# EAGLE board motherboard_schematic_ver_1_0 (EAGLE 7.5.0), part 1 of 2
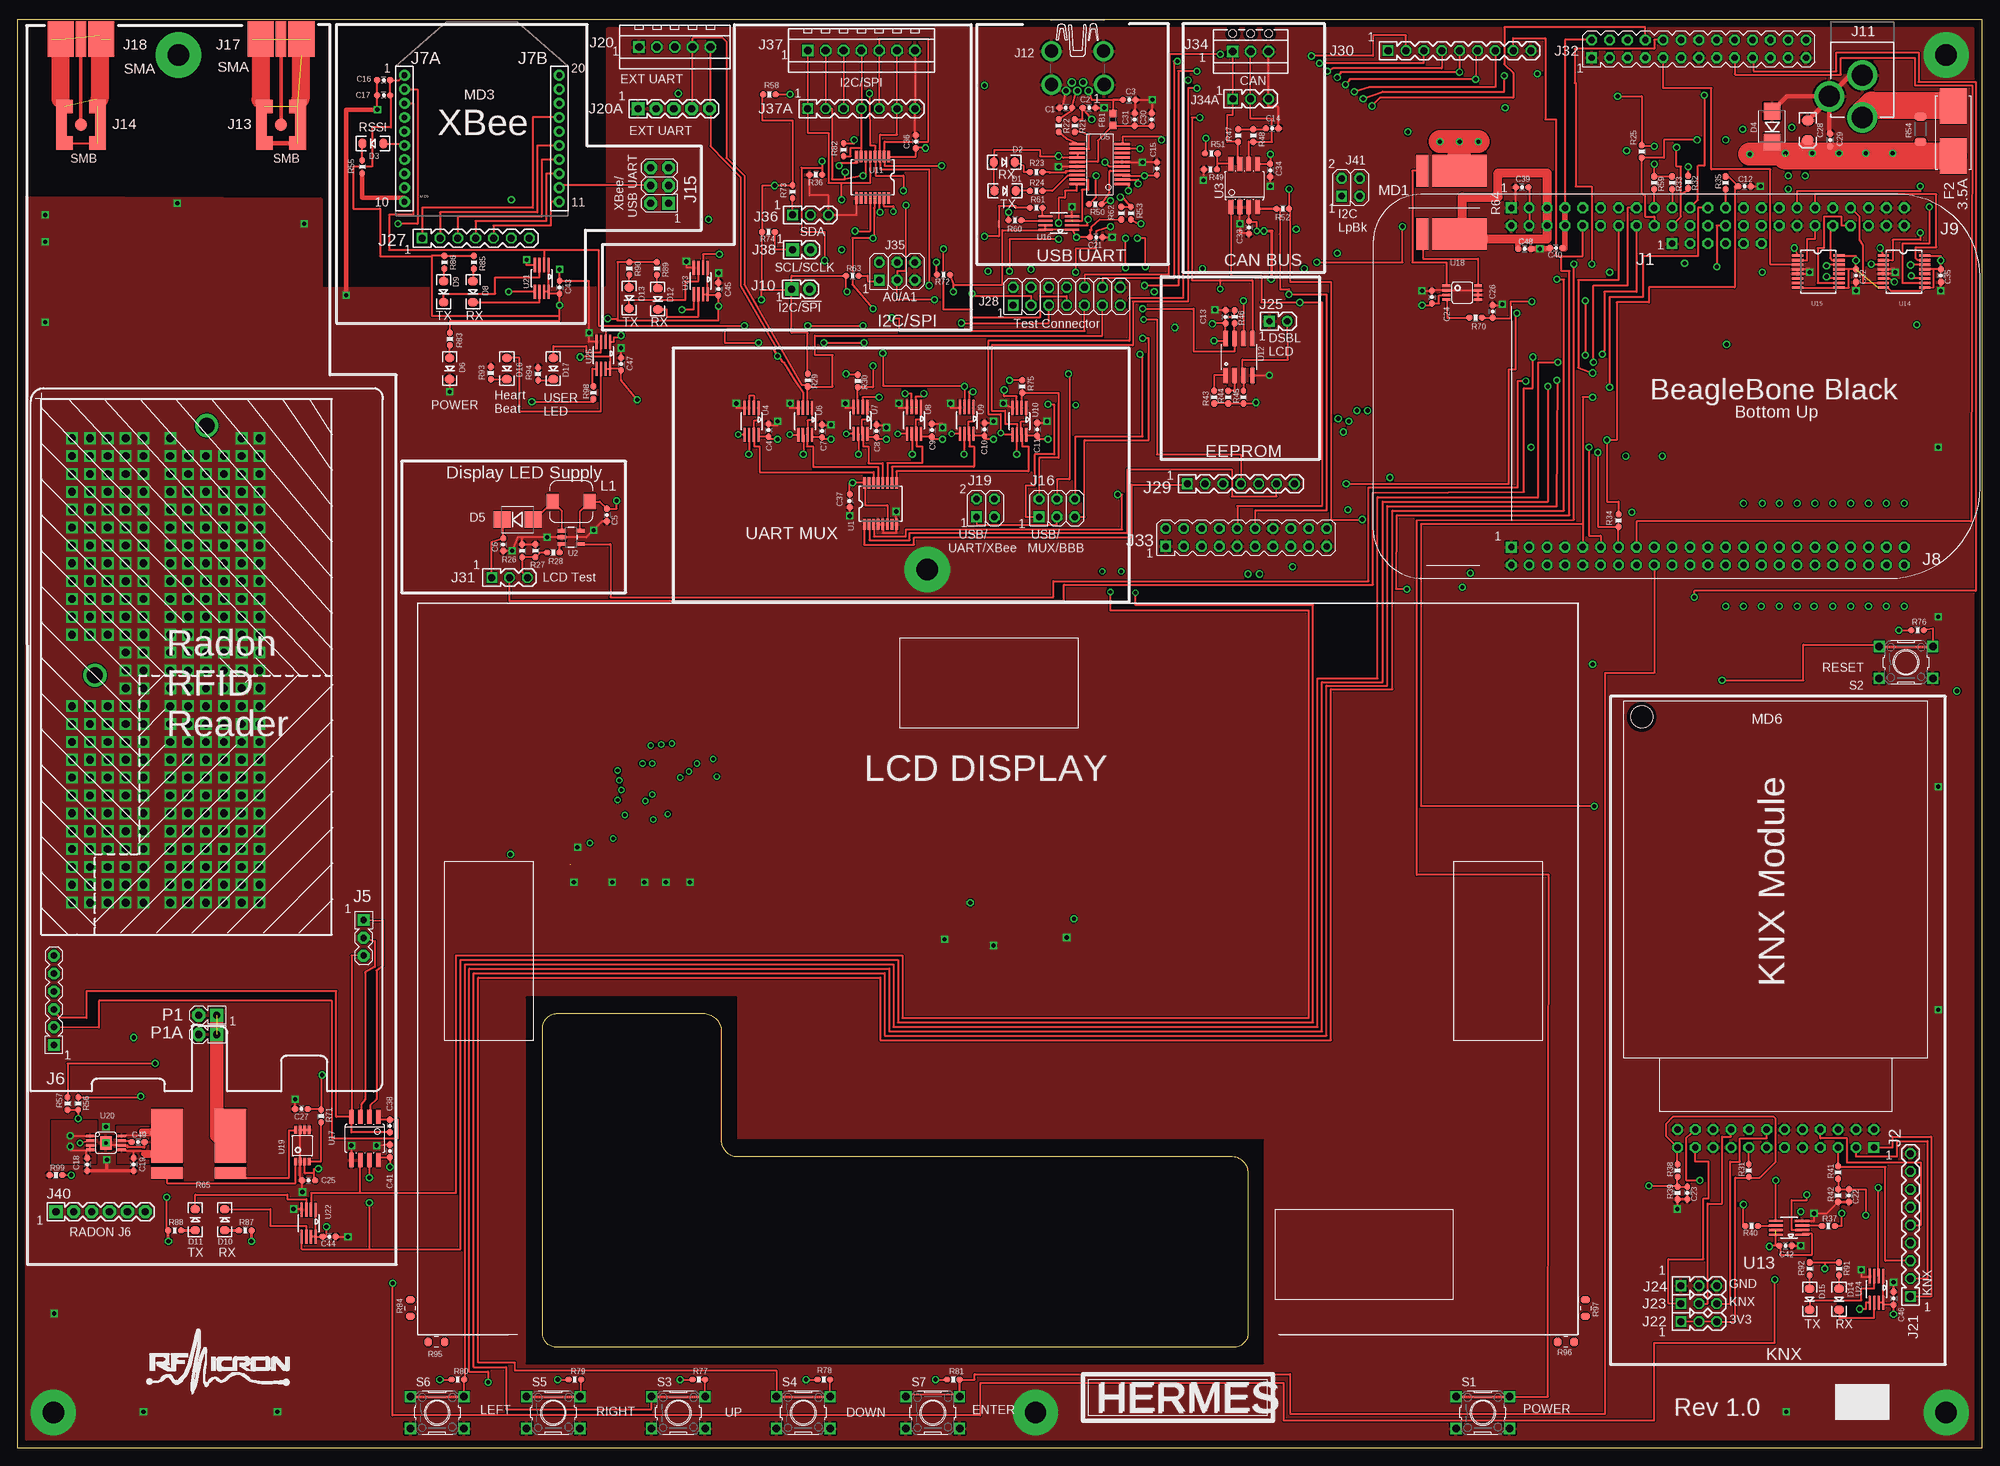
[diagram p9: board, top side]
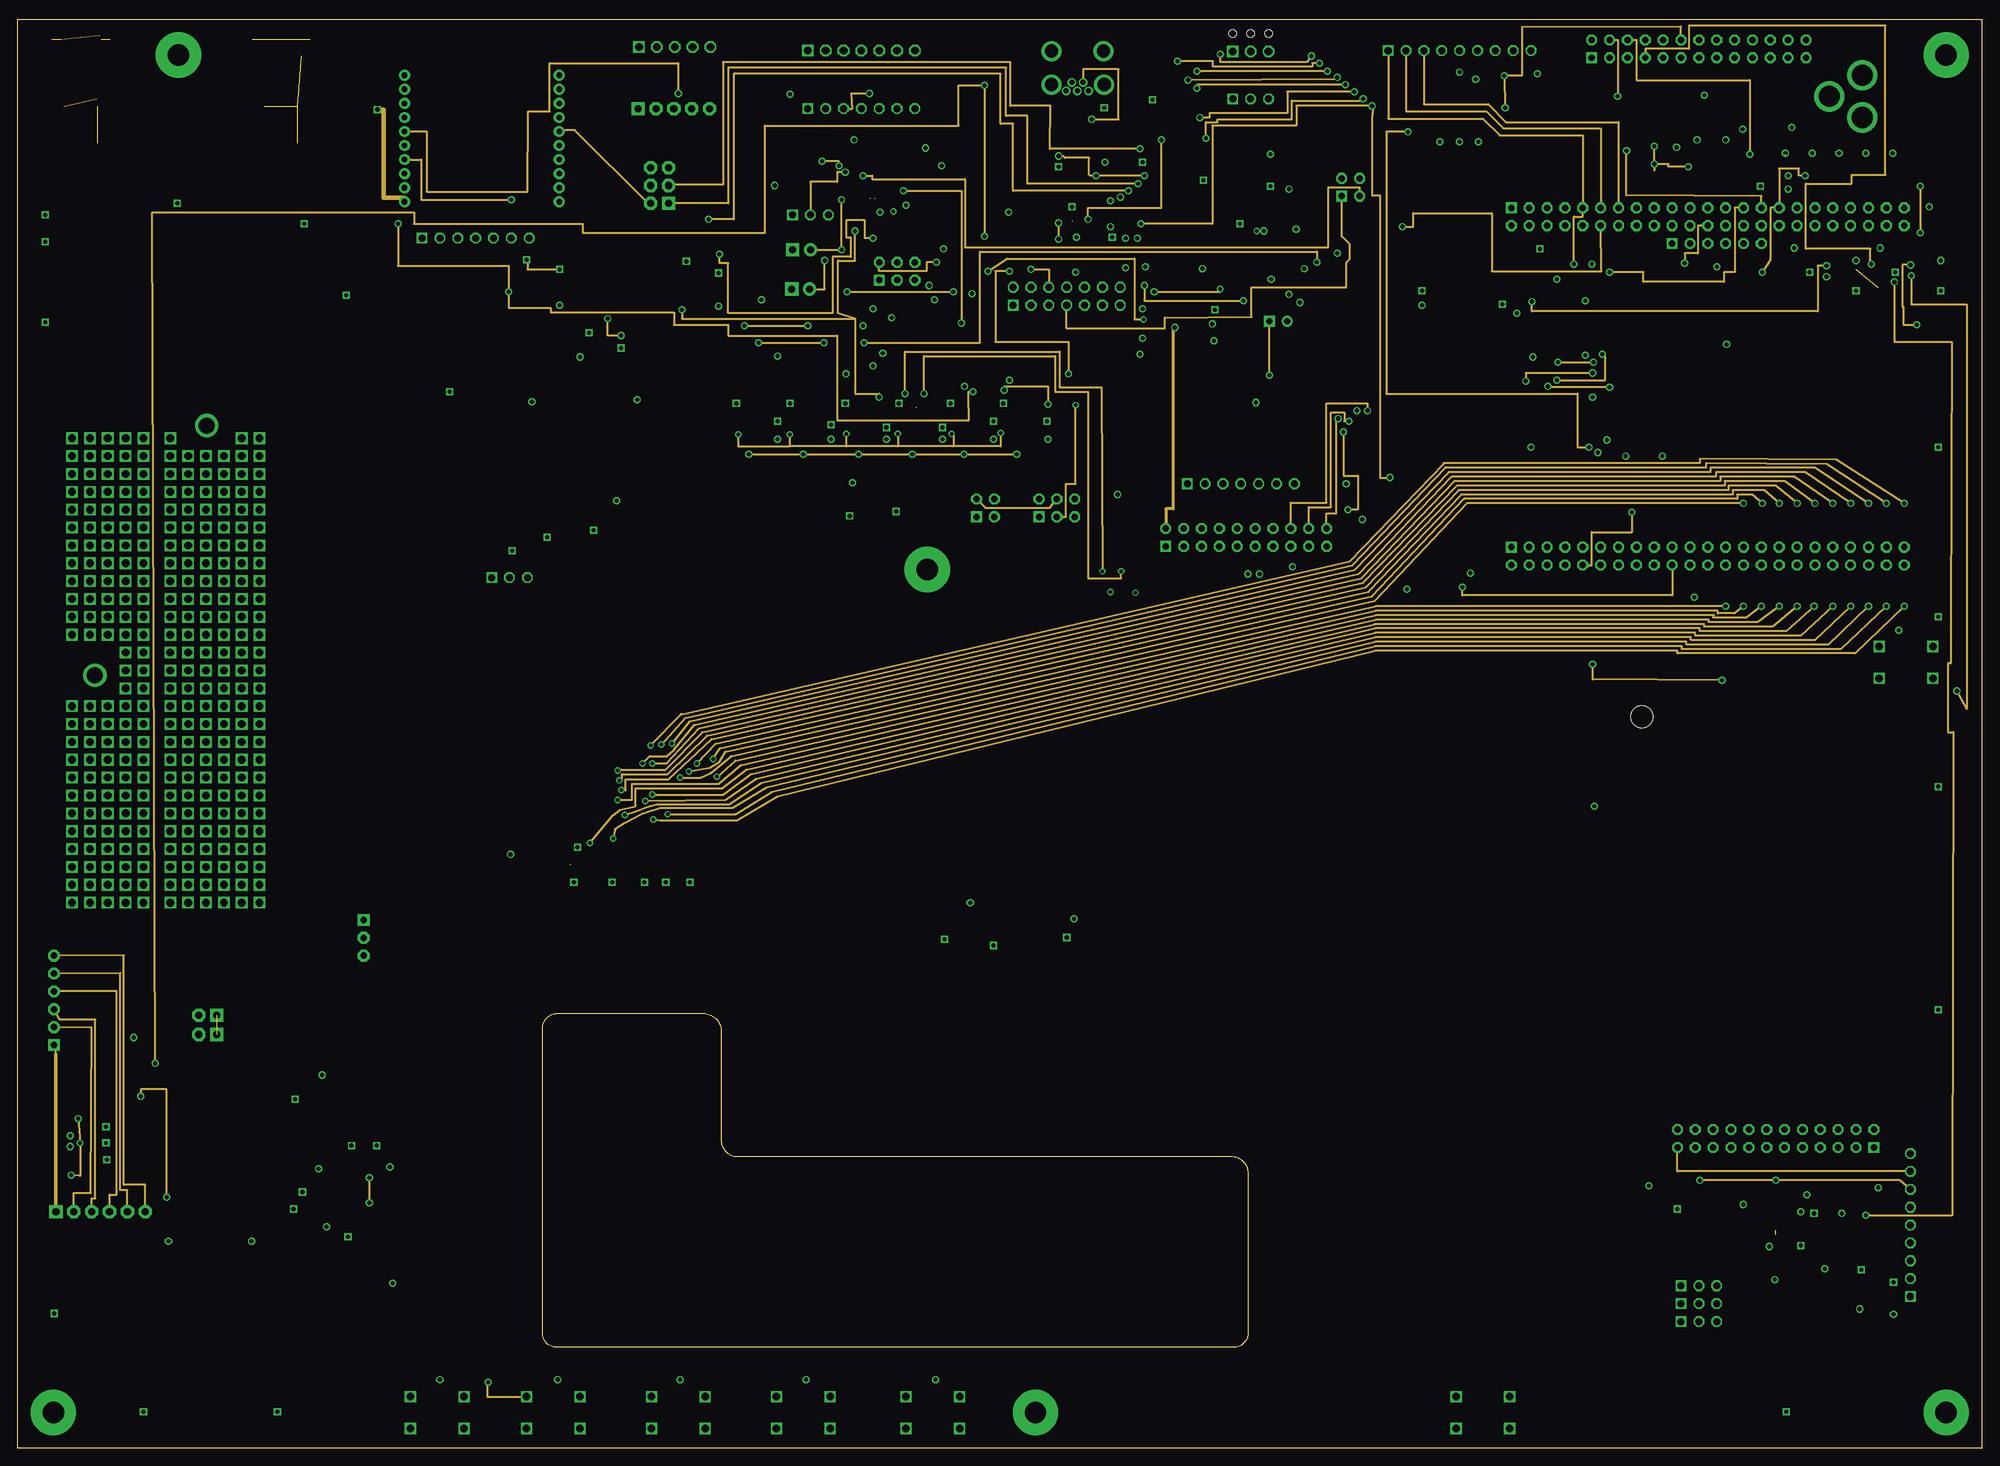
[diagram p10: board, inner layer SI1]
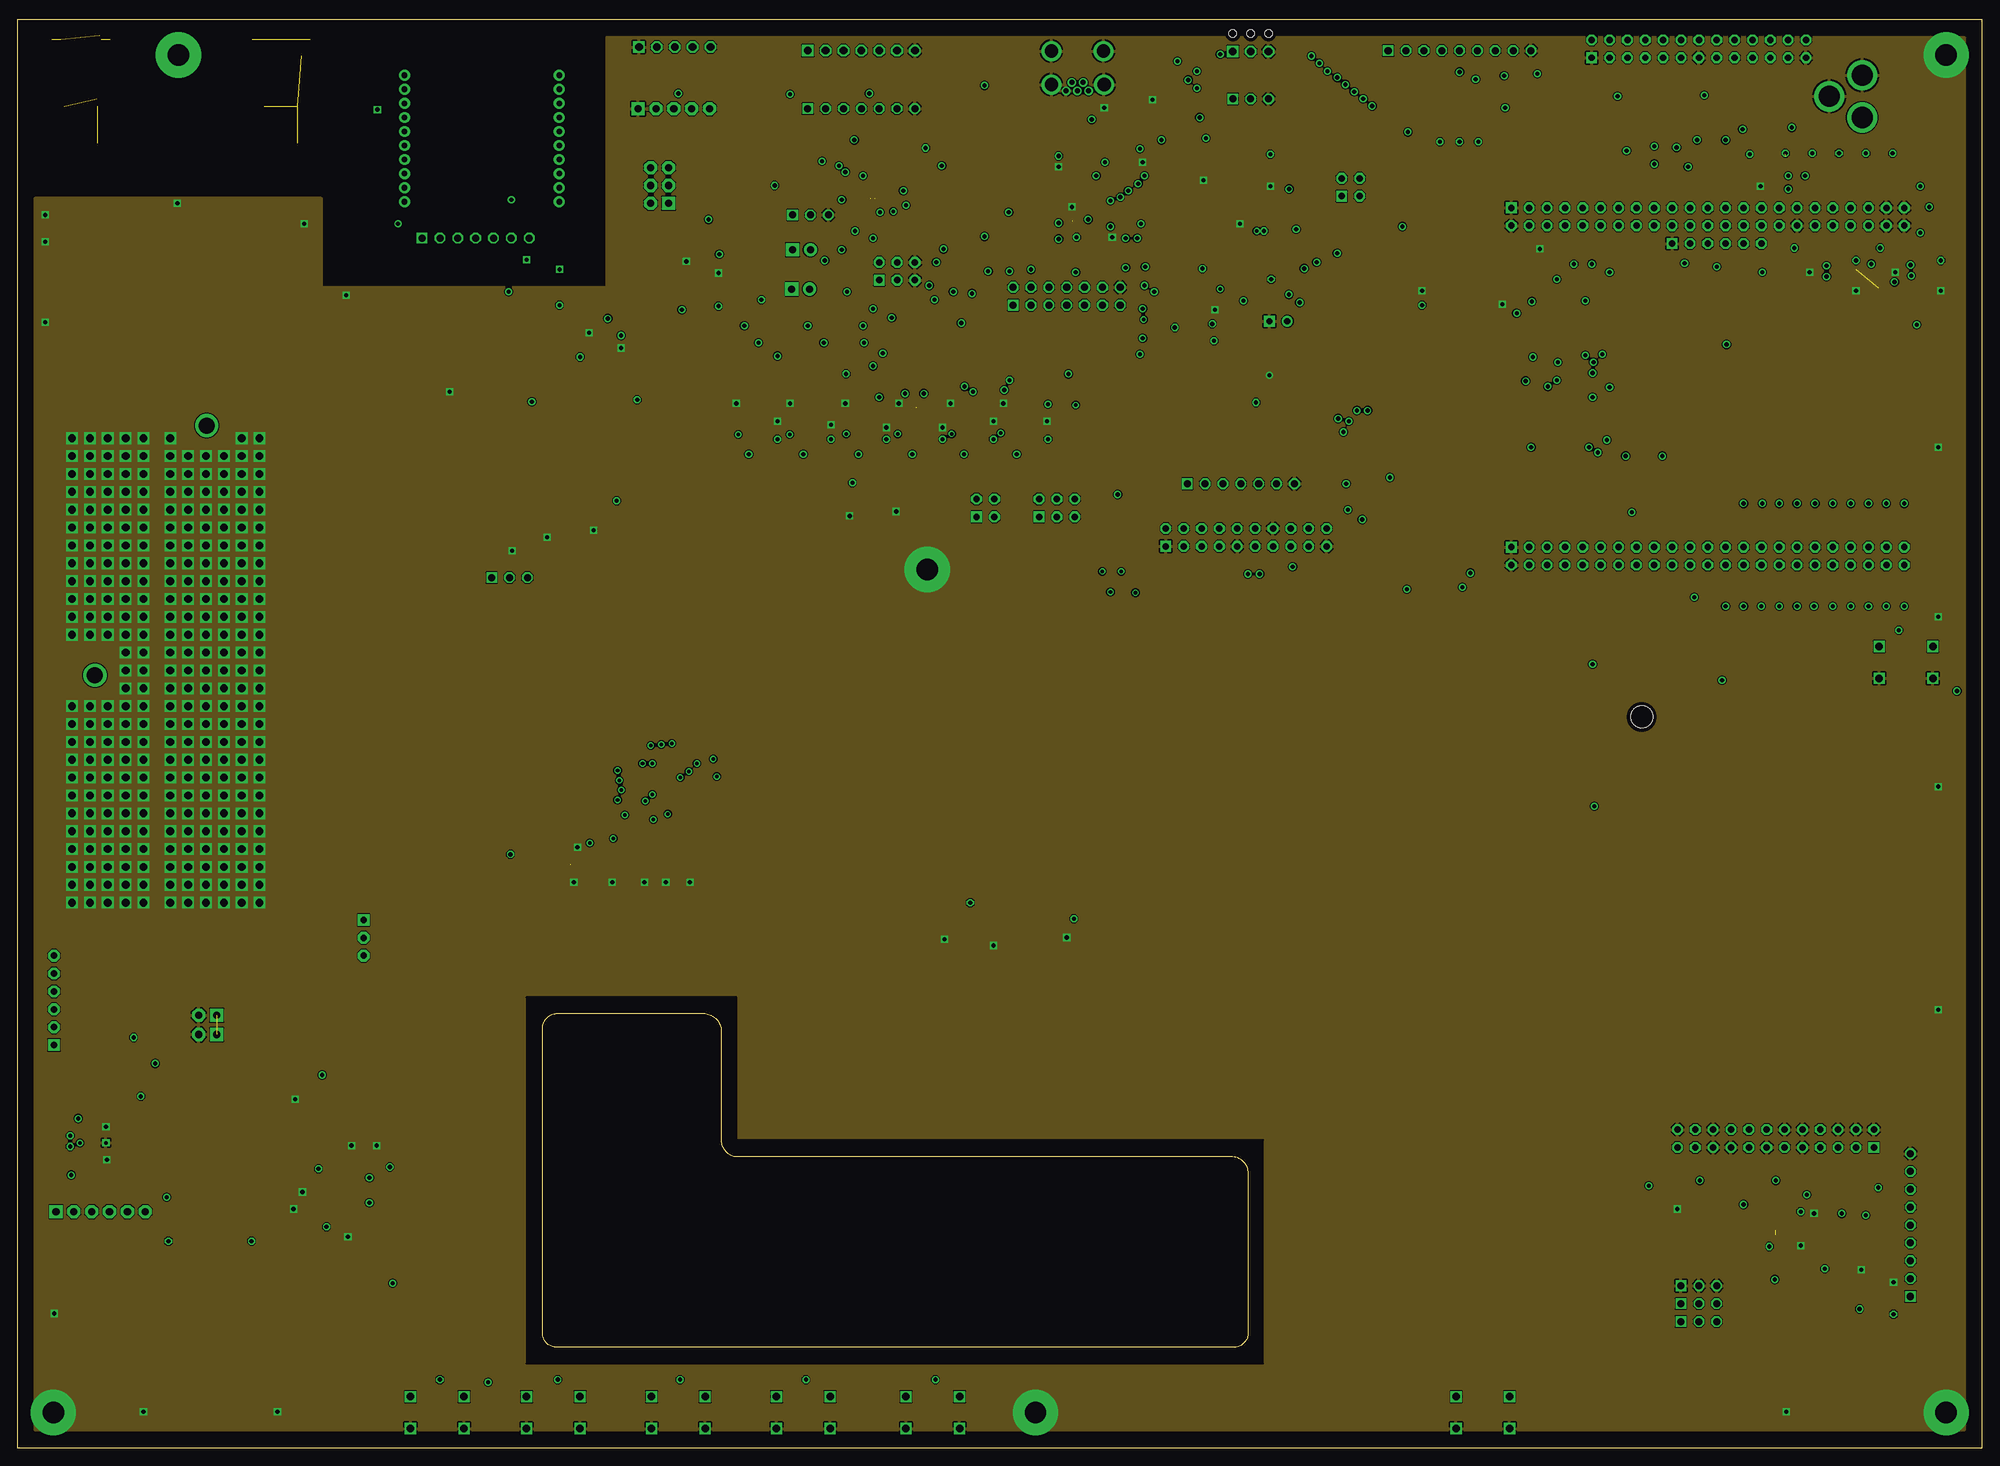
[diagram p11: board, inner layer GND]
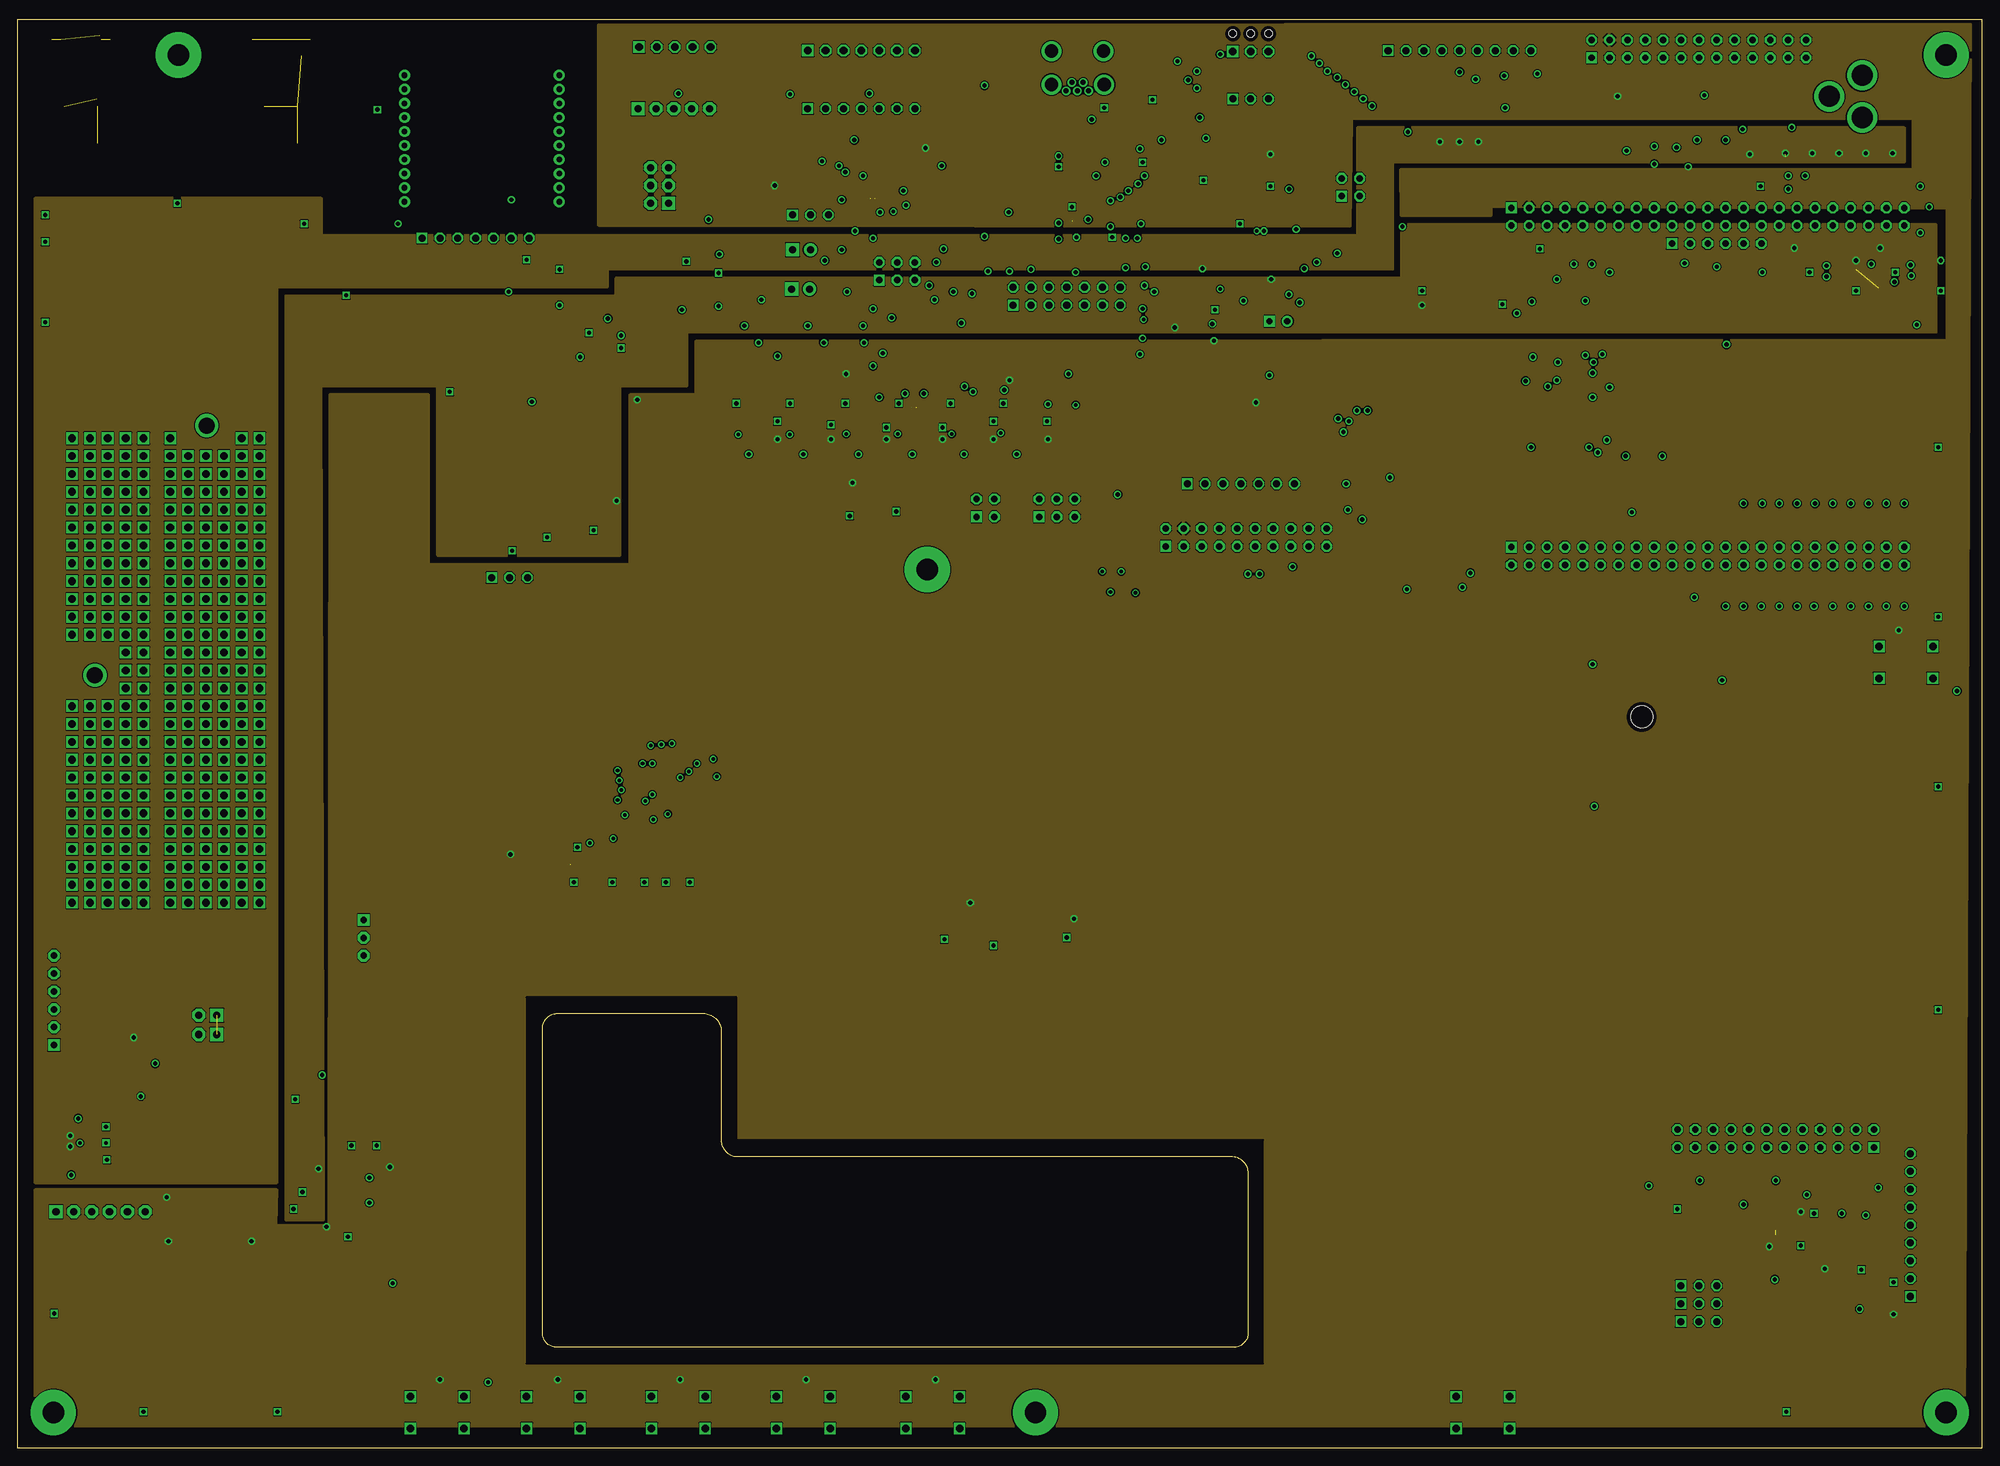
[diagram p12: board, inner layer PWR]
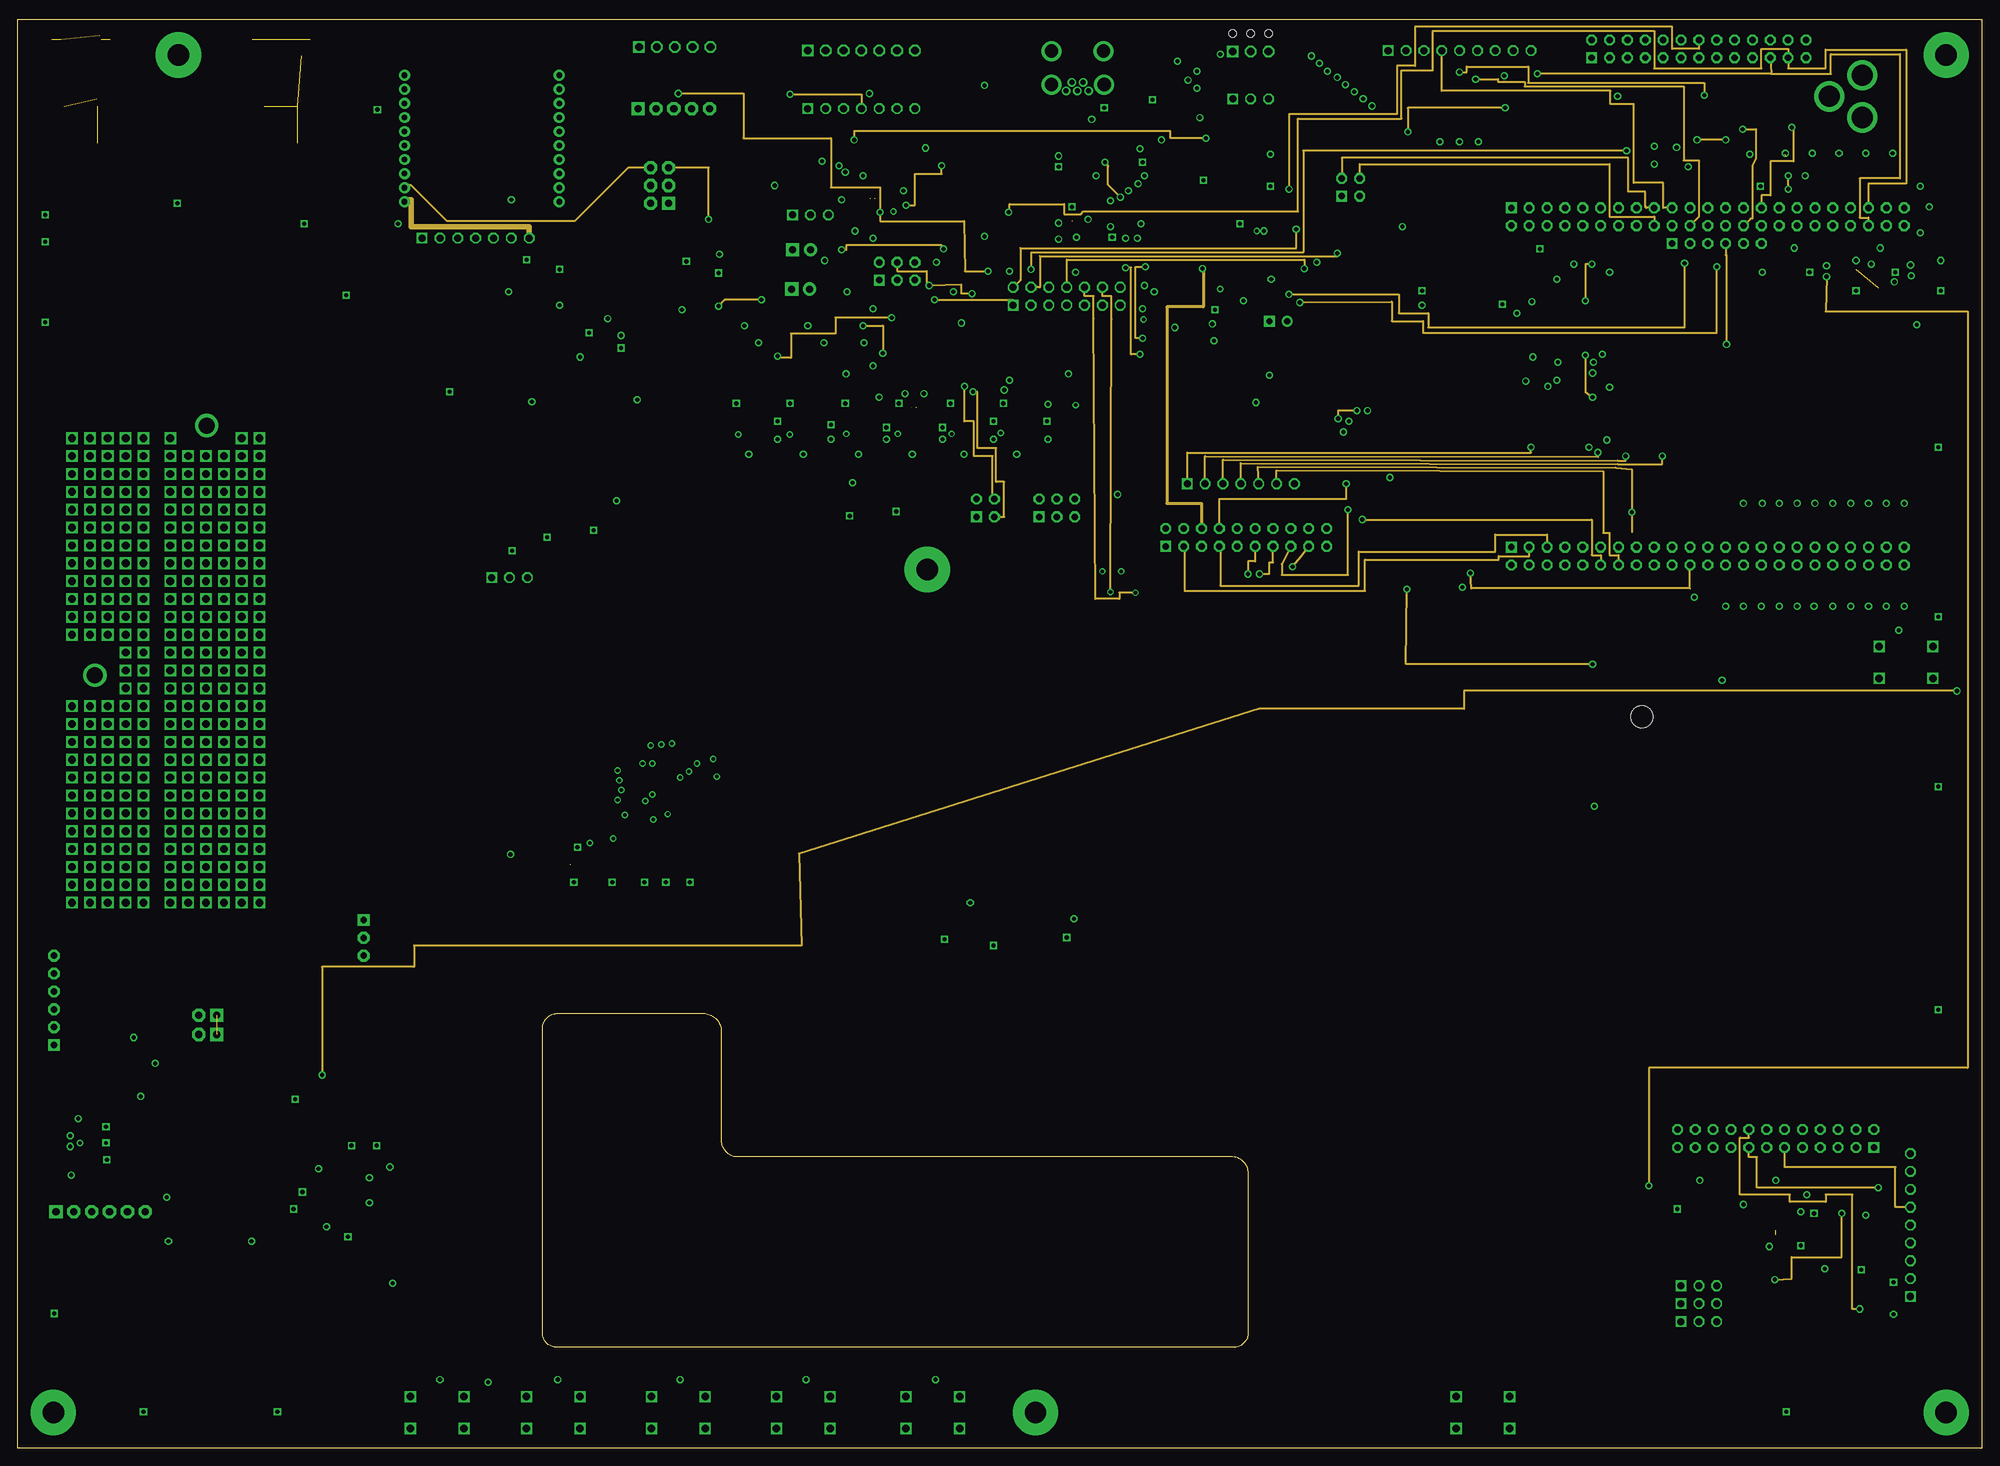
[diagram p13: board, inner layer SI2]
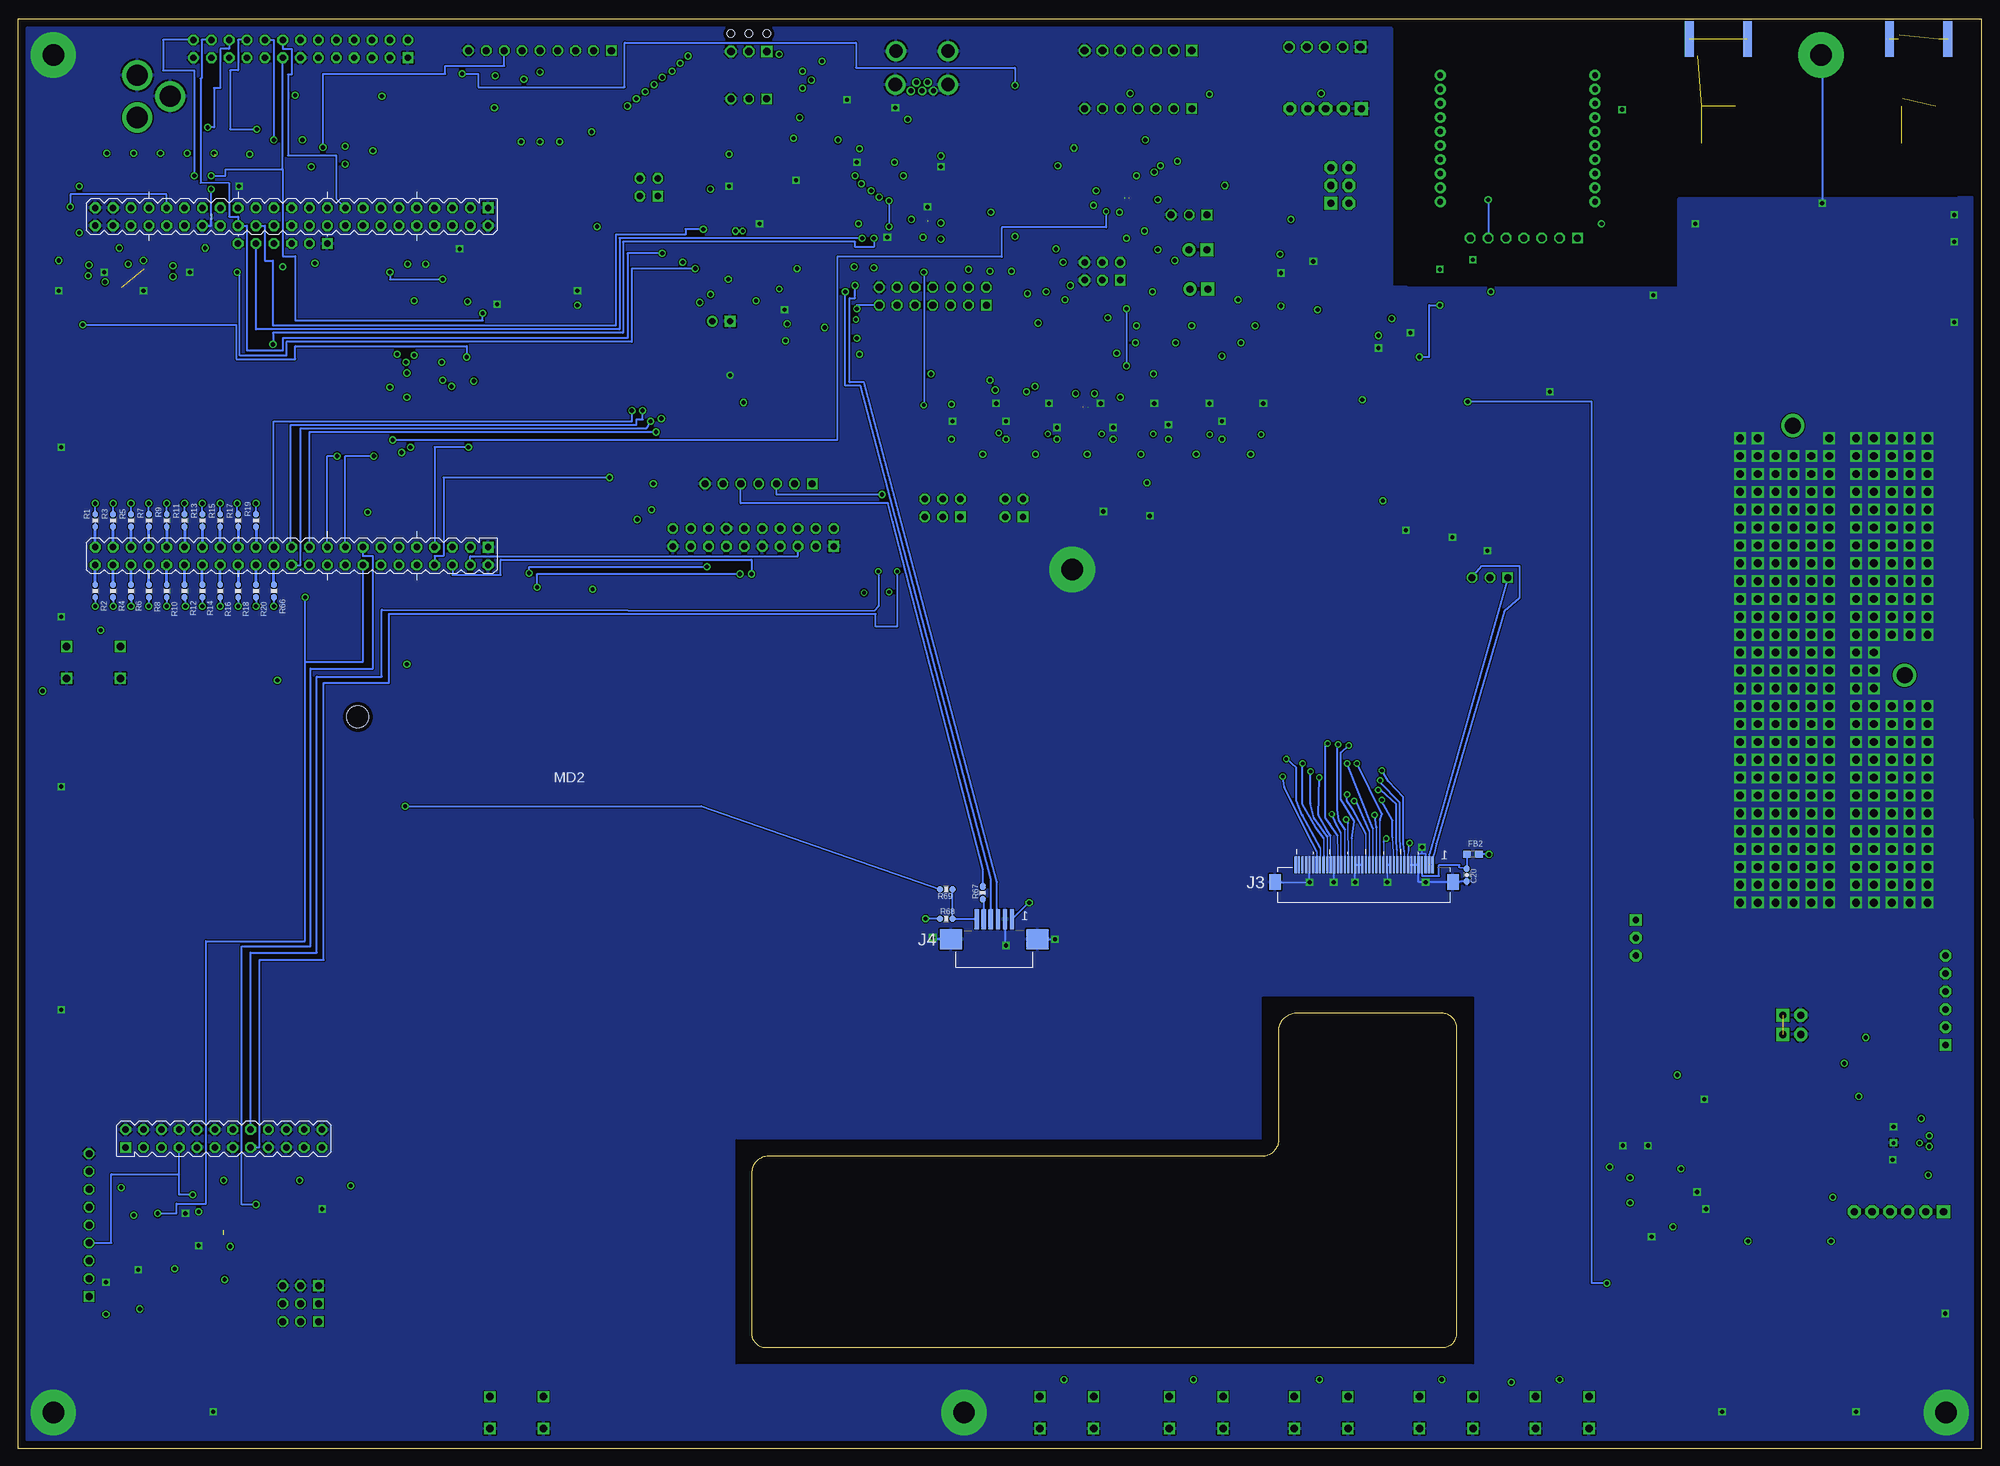
[diagram p14: board, bottom side, seen from below]

Size 279.4 x 203.2 mm. Coordinates in mm from the lower left corner, seen from the top.
Outline: 0,0 0,203.2 279.4,203.2 279.4,0 0,0
Copper layers (1*2+3*4+5*16): Top 0.035mm / dielectric 1.5mm / SI1 0.035mm / dielectric 0.15mm / GND 0.035mm / dielectric 0.2mm / PWR 0.035mm / dielectric 0.15mm / SI2 0.035mm / dielectric 0.2mm / Bottom 0.035mm
Design rules "default *": minimum track width 6mil, minimum drill 0.3mm, track to track 6mil, track to pad 6mil, pad to pad 6mil, via to via 8mil, smd to smd 6mil, copper to edge 20mil, drill to drill 8mil, minimum pad ring 10mil, minimum via ring 8mil, stop-mask expansion 6mil, vias tented up to drill 0mil, thermal gap 10mil

## Footprints (pad centres in the part's own frame; a part is rotated, then mirrored left to right if it is on the bottom)
0603-CAP = smd 0.9 x 0.8: 1 -0.9,0; 2 0.9,0
EIA3216 = smd 1.4 x 1.6: A 1.4,0; C -1.4,0
LED-1206 = smd 1.2 x 1.4: A -1.5,0; C 1.5,0
SC-110A-POWER_DIODE = smd 2.4 x 2.4: A 2.2,0; C -2.2,0
SMB-DIODE = smd 2.4 x 2.4: A 2.2,0; C -2.2,0
NAMECHANGE = smd 0.635 x 0.203: 1 0,0; 2 0.254,0
MTHOLE4-40 = drill 3.048 pad 6.452: 1 0,0
FUSE_OMNI-BLOCK-154 = smd 5 x 3.81: 1 -3.565,0; 2 3.565,0
0603 = smd 1.1 x 1: 1 -0.85,0; 2 0.85,0
1X2 = drill 1.016 pad 1.88 square: 1 -1.27,0 | drill 1.016 pad 1.88: 2 1.27,0
POWER_JACK_PTH = drill 2.997 pad 4.318: 1 0,13.7; 2 0,7.7; 3 4.7,10.7
USBMINI-TH = drill 0.7: 1 1.6,-0.9; 2 0.8,0.3; 3 0,-0.9; 4 -0.8,0.3; 5 -1.6,-0.9 | drill 1.9 pad 2.54: 6 -3.7,0; 7 -3.7,4.75; 8 3.7,4.75; 9 3.8,0
SMB-SMD = smd 1.73 x 1.73: 1 0,0 | smd 2.35 x 1.9: 2 -2.375,-2.6; 3 2.375,-2.6; 4 2.375,2.6; 5 -2.375,2.6 | smd 1.5 x 3.4: 2@5 -2.8,0; 2@6 2.8,0
2X3 = drill 1.016 pad 1.88 square: 1 -2.54,-1.27 | drill 1.016 pad 1.88 octagon: 2 -2.54,1.27; 3 0,-1.27; 4 0,1.27; 5 2.54,-1.27; 6 2.54,1.27
2X3SM = drill 0.914 pad 1.524 square: 1 -2.54,-1.27 | drill 0.914 pad 1.524 octagon: 2 -2.54,1.27; 3 0,-1.27; 4 0,1.27; 5 2.54,-1.27; 6 2.54,1.27
SMA-EDGE = smd 5.08 x 1.524: 1 0,0 | smd 5.08 x 3.746: 2 0,2.889; 3 0,-2.889 | smd 5.08 x 1.27 bottom: 4 0,4.128; 5 0,-4.128
2X2SM = drill 0.914 pad 1.524 square: 1 -1.27,-1.27 | drill 0.914 pad 1.524 octagon: 2 -1.27,1.27; 3 1.27,-1.27; 4 1.27,1.27
PHOENIX1725685-5 = drill 1.1 pad 1.422 square: 1 0,0 | drill 1.1 pad 1.5 octagon: 2 2.54,0; 3 5.08,0; 4 7.62,0; 5 10.16,0
1X05 = drill 1.016 pad 1.88 square: 1 -5.08,0 | drill 1.016 pad 1.88 octagon: 2 -2.54,0; 3 0,0; 4 2.54,0; 5 5.08,0
1X09-SPECIAL = drill 1 pad 1.422 square: 1 -10.16,0 | drill 1 pad 1.422 octagon: 2 -7.62,0; 3 -5.08,0; 4 -2.54,0; 5 0,0; 6 2.54,0; 7 5.08,0; 8 7.62,0; 9 10.16,0
1X03-SPECIAL = drill 1 pad 1.422 square: 1 -3.81,0 | drill 1 pad 1.422 octagon: 2 -1.27,0; 3 1.27,0
1X2SM = drill 0.914 pad 1.524 square: 1 -1.27,0 | drill 0.914 pad 1.524: 2 1.27,0
1X07-SPECIAL = drill 1 pad 1.422 square: 1 -6.35,0 | drill 1 pad 1.422 octagon: 2 -3.81,0; 3 -1.27,0; 4 1.27,0; 5 3.81,0; 6 6.35,0; 7 8.89,0
2X7SM = drill 1.016 pad 1.524 square: 1 -8.89,-1.27 | drill 1.016 pad 1.524 octagon: 2 -8.89,1.27; 3 -6.35,-1.27; 4 -6.35,1.27; 5 -3.81,-1.27; 6 -3.81,1.27; 7 -1.27,-1.27; 8 -1.27,1.27; 9 1.27,-1.27; 10 1.27,1.27; 11 3.81,-1.27; 12 3.81,1.27; 13 6.35,-1.27; 14 6.35,1.27
2X13-SM = drill 0.914 pad 1.524 square: 1 -13.97,-1.27 | drill 0.914 pad 1.524 octagon: 2 -13.97,1.27; 3 -11.43,-1.27; 4 -11.43,1.27; 5 -8.89,-1.27; 6 -8.89,1.27; 7 -6.35,-1.27; 8 -6.35,1.27; 9 -3.81,-1.27; 10 -3.81,1.27; 11 -1.27,-1.27; 12 -1.27,1.27; 13 1.27,-1.27; 14 1.27,1.27; 15 3.81,-1.27; 16 3.81,1.27; 17 6.35,-1.27; 18 6.35,1.27; 19 8.89,-1.27; 20 8.89,1.27; 21 11.43,-1.27; 22 11.43,1.27; 23 13.97,-1.27; 24 13.97,1.27; 25 16.51,-1.27; 26 16.51,1.27
2X10SM = drill 0.914 pad 1.524 square: 1 -11.43,-1.27 | drill 0.914 pad 1.524 octagon: 2 -11.43,1.27; 3 -8.89,-1.27; 4 -8.89,1.27; 5 -6.35,-1.27; 6 -6.35,1.27; 7 -3.81,-1.27; 8 -3.81,1.27; 9 -1.27,-1.27; 10 -1.27,1.27; 11 1.27,-1.27; 12 1.27,1.27; 13 3.81,-1.27; 14 3.81,1.27; 15 6.35,-1.27; 16 6.35,1.27; 17 8.89,-1.27; 18 8.89,1.27; 19 11.43,-1.27; 20 11.43,1.27
PHOENIX1725669-3 = drill 1.1 pad 1.422 square: 1 0,0 | drill 1.1 pad 1.5 octagon: 2 2.54,0; 3 5.08,0 | hole 1.1: 0,2.54; 2.54,2.54; 5.08,2.54
PHOENIX1725708-7 = drill 1.1 pad 1.5 square: 1 0,0 | drill 1.1 pad 1.5 octagon: 2 2.54,0; 3 5.08,0; 4 7.62,0; 5 10.16,0; 6 12.7,0; 7 15.24,0
1X06 = drill 1.016 pad 1.88 square: 1 0,0 | drill 1.016 pad 1.88 octagon: 2 2.54,0; 3 5.08,0; 4 7.62,0; 5 10.16,0; 6 12.7,0
TDK_CA = smd 1.7 x 2.2: 1 -2.65,0; 2 2.65,0
BBONE_BK = drill 0.914 pad 1.524 square: 1 19.685,4.445; `1 42.545,47.625; ~1 19.685,52.705 | drill 0.914 pad 1.524 octagon: 2 19.685,1.905; 3 22.225,4.445; 4 22.225,1.905; 5 24.765,4.445; 6 24.765,1.905; 7 27.305,4.445; 8 27.305,1.905; 9 29.845,4.445; 10 29.845,1.905; 11 32.385,4.445; 12 32.385,1.905; 13 34.925,4.445; 14 34.925,1.905; 15 37.465,4.445; 16 37.465,1.905; 17 40.005,4.445; 18 40.005,1.905; 19 42.545,4.445; 20 42.545,1.905; 21 45.085,4.445; 22 45.085,1.905; 23 47.625,4.445; 24 47.625,1.905; 25 50.165,4.445; 26 50.165,1.905; 27 52.705,4.445; 28 52.705,1.905; 29 55.245,4.445; 30 55.245,1.905; 31 57.785,4.445; 32 57.785,1.905; 33 60.325,4.445; 34 60.325,1.905; 35 62.865,4.445; 36 62.865,1.905; 37 65.405,4.445; 38 65.405,1.905; 39 67.945,4.445; 40 67.945,1.905; 41 70.485,4.445; 42 70.485,1.905; 43 73.025,4.445; 44 73.025,1.905; 45 75.565,4.445; 46 75.565,1.905; `2 45.085,47.625; `3 47.625,47.625; `4 50.165,47.625; `5 52.705,47.625; `6 55.245,47.625; ~2 19.685,50.165; ~3 22.225,52.705; ~4 22.225,50.165; ~5 24.765,52.705; ~6 24.765,50.165; ~7 27.305,52.705; ~8 27.305,50.165; ~9 29.845,52.705; ~10 29.845,50.165; ~11 32.385,52.705; ~12 32.385,50.165; ~13 34.925,52.705; ~14 34.925,50.165; ~15 37.465,52.705; ~16 37.465,50.165; ~17 40.005,52.705; ~18 40.005,50.165; ~19 42.545,52.705; ~20 42.545,50.165; ~21 45.085,52.705; ~22 45.085,50.165; ~23 47.625,52.705; ~24 47.625,50.165; ~25 50.165,52.705; ~26 50.165,50.165; ~27 52.705,52.705; ~28 52.705,50.165; ~29 55.245,52.705; ~30 55.245,50.165; ~31 57.785,52.705; ~32 57.785,50.165; ~33 60.325,52.705; ~34 60.325,50.165; ~35 62.865,52.705; ~36 62.865,50.165; ~37 65.405,52.705; ~38 65.405,50.165; ~39 67.945,52.705; ~40 67.945,50.165; ~41 70.485,52.705; ~42 70.485,50.165; ~43 73.025,52.705; ~44 73.025,50.165; ~45 75.565,52.705; ~46 75.565,50.165
NEWHAVEN_LCD_NHD-7.0-800480EF = smd 0.305 x 2.4 bottom: 1 21.241,66.858; 2 21.724,66.858; 3 22.232,66.858; 4 22.74,66.858; 5 23.222,66.858; 6 23.73,66.858; 7 24.238,66.858; 8 24.721,66.858; 9 25.229,66.858; 10 25.737,66.858; 11 26.241,66.858; 12 26.724,66.858; 13 27.232,66.858; 14 27.74,66.858; 15 28.222,66.858; 16 28.73,66.858; 17 29.238,66.858; 18 29.721,66.858; 19 30.229,66.858; 20 30.737,66.858; 21 31.219,66.858; 22 31.727,66.858; 23 32.235,66.858; 24 32.718,66.858; 25 33.226,66.858; 26 33.734,66.858; 27 34.242,66.858; 28 34.725,66.858; 29 35.233,66.858; 30 35.741,66.858; 31 36.223,66.858; 32 36.731,66.858; 33 37.239,66.858; 34 37.722,66.858; 35 38.23,66.858; 36 38.738,66.858; 37 39.22,66.858; 38 39.728,66.858; 39 40.236,66.858; 40 40.719,66.858 | smd 1.6 x 2.21 bottom: 41 18.32,64.395; 42 43.64,64.395 | smd 0.6 x 2.9 bottom: ~1 81.07,59.108; ~2 82.07,59.108; ~3 83.07,59.108; ~4 84.07,59.108; ~5 85.07,59.108; ~6 86.07,59.108 | smd 3.1 x 2.8 bottom: ~7 77.42,56.258; ~8 89.72,56.258
XBEE-2 = drill 0.8 pad 1.524: 1 -11,6.03; 2 -11,4.03; 3 -11,2.03; 4 -11,0.03; 5 -11,-1.97; 6 -11,-3.97; 7 -11,-5.97; 8 -11,-7.97; 9 -11,-9.97; 10 -11,-11.97; 11 11,-11.97; 12 11,-9.97; 13 11,-7.97; 14 11,-5.97; 15 11,-3.97; 16 11,-1.97; 17 11,0.03; 18 11,2.03; 19 11,4.03; 20 11,6.03
RADON_RFID_READ = drill 0.914 pad 1.676 square: 1 93.396,3.277; `1 75.616,47.32 | drill 0.914 pad 1.676 octagon: 2 90.856,3.277; 3 88.316,3.277; 4 85.776,3.277; 5 83.236,3.277; 6 80.696,3.277; `2 78.156,47.32; `3 80.696,47.32 | drill 2.286: P$1 5.309,24.994; P$2 40.818,9.093 | drill 1.016 pad 1.88 square: ~1 89.154,26.416; ~3 91.897,26.416 | drill 1.016 pad 1.88 octagon: ~2 89.154,23.876; ~4 91.897,23.876
KNX-1 = drill 0.914 pad 1.524 square: 1 -12.7,7.62 | drill 0.914 pad 1.524 octagon: 2 -10.16,7.62; 3 -12.7,10.16; 4 -10.16,10.16; 5 -12.7,12.7; 6 -10.16,12.7; 7 -12.7,15.24; 8 -10.16,15.24; 9 -12.7,17.78; 10 -10.16,17.78; 11 -12.7,20.32; 12 -10.16,20.32; 13 -12.7,22.86; 14 -10.16,22.86; 15 -12.7,25.4; 16 -10.16,25.4; 17 -12.7,27.94; 18 -10.16,27.94; 19 -12.7,30.48; 20 -10.16,30.48; 21 -12.7,33.02; 22 -10.16,33.02; 23 -12.7,35.56; 24 -10.16,35.56 | hole 3.175: 48.514,40.64
0603-RES = smd 0.9 x 0.8: 1 -0.9,0; 2 0.9,0
1206 = smd 1.25 x 1.7: 1 -1.775,0; 2 1.775,0
RESIST_4-TERM_VISHAY = smd 4.5 x 7.71: 1 -4.51,0; 2 4.51,0 | smd 4.5 x 1.68: 3 -4.51,5.305; 4 4.51,5.305
0805-RES = smd 1.05 x 1.3: 1 -1.175,0; 2 1.175,0
EVQ-PAC04M = drill 1.067 square: 1 -3.81,2.261; 2 3.81,2.261; 3 -3.81,-2.261; 4 3.81,-2.261
TSSOP16 = smd 0.4 x 1.6: 1 -2.225,-2.85; 2 -1.575,-2.85; 3 -0.925,-2.85; 4 -0.275,-2.85; 5 0.375,-2.85; 6 1.025,-2.85; 7 1.675,-2.85; 8 2.325,-2.85; 9 2.325,3.05; 10 1.675,3.05; 11 1.025,3.05; 12 0.375,3.05; 13 -0.275,3.05; 14 -0.925,3.05; 15 -1.575,3.05; 16 -2.225,3.05
TSOT-23-5 = smd 0.55 x 1.2: 1 -0.95,-1.3; 2 0,-1.3; 3 0.95,-1.3; 4 0.95,1.3; 5 -0.95,1.3
SOIC08 = smd 0.66 x 2.032: 1 -1.905,-3.073; 2 -0.635,-3.073; 3 0.635,-3.073; 4 1.905,-3.073; 5 1.905,3.073; 6 0.635,3.073; 7 -0.635,3.073; 8 -1.905,3.073
SM8-TI-A = smd 0.3 x 2: 1 -0.975,-1.9; 2 -0.325,-1.9; 3 0.325,-1.9; 4 0.975,-1.9; 5 0.975,1.9; 6 0.325,1.9; 7 -0.325,1.9; 8 -0.975,1.9
SSOP20-.150 = smd 0.35 x 2.2: 1 -2.857,-3.2; 2 -2.223,-3.2; 3 -1.587,-3.2; 4 -0.953,-3.2; 5 -0.318,-3.2; 6 0.318,-3.2; 7 0.953,-3.2; 8 1.587,-3.2; 9 2.223,-3.2; 10 2.857,-3.2; 11 2.857,3.2; 12 2.223,3.2; 13 1.587,3.2; 14 0.953,3.2; 15 0.318,3.2; 16 -0.318,3.2; 17 -0.953,3.2; 18 -1.587,3.2; 19 -2.223,3.2; 20 -2.857,3.2
SO08 = smd 0.61 x 2.21: 1 -1.905,-2.616; 2 -0.635,-2.616; 3 0.635,-2.616; 4 1.905,-2.616; 5 1.905,2.616; 6 0.635,2.616; 7 -0.635,2.616; 8 -1.905,2.616
MSOP8 = smd 0.4 x 1.1: 1 -0.975,-2.25; 2 -0.325,-2.25; 3 0.325,-2.25; 4 0.975,-2.25; 5 0.975,2.25; 6 0.325,2.25; 7 -0.325,2.25; 8 -0.975,2.25
MSOP8-POWERPAD = smd 0.4 x 1.1: 1 -0.975,-2.25; 2 -0.325,-2.25; 3 0.325,-2.25; 4 0.975,-2.25; 5 0.975,2.25; 6 0.325,2.25; 7 -0.325,2.25; 8 -0.975,2.25 | smd 1.89 x 1.57: 9 0,0 | drill 0.5 square: 10 0,0

## Placement (x,y rotation side)
C1  47pF  [0603-CAP]  149.1,190.63 180 top
C2  47pF  [0603-CAP]  152.4,190.63 0 top
C3  10nF  [0603-CAP]  158.12,191.77 0 top
C4  0.1uF  [0603-CAP]  106.81,144.78 270 top
C5  4.7uF 10V  [0603-CAP]  83.82,132.72 270 top
C6  1uF 35V  [0603-CAP]  69.09,128.52 270 top
C7  0.1uF  [0603-CAP]  114.43,144.65 270 top
C8  0.1uF  [0603-CAP]  122.17,144.65 270 top
C9  0.1uF  [0603-CAP]  130.05,144.78 270 top
C10  0.1uF  [0603-CAP]  137.54,144.91 270 top
C11  0.1uF  [0603-CAP]  145.03,144.91 270 top
C12  DNP  [0603-CAP]  245.62,179.45 0 top
C13  0.1uF  [0603-CAP]  171.83,160.91 90 top
C14  4.7nF  [0603-CAP]  178.44,187.71 0 top
C15  100nF  [0603-CAP]  162.05,181.99 90 top
C16  8.2pF  [0603-CAP]  52.07,194.56 180 top
C17  1uF  [0603-CAP]  52.07,192.41 180 top
C18  4.7uF  [0603-CAP]  9.91,40.39 270 top
C19  0.1uF  [0603-CAP]  16.51,40.39 270 top
C20  0.01uF  [0603-CAP]  73.28,81.53 270 bottom
C21  100nF DNP  [0603-CAP]  153.42,172.21 180 top
C22  DNP  [0603-CAP]  260.48,35.94 270 top
C23  DNP  [0603-CAP]  237.49,36.32 270 top
C24  0.1uF  [0603-CAP]  201.17,163.7 270 top
C25  0.1uF  [0603-CAP]  41.4,38.1 0 top
C26  DNP  [0603-CAP]  209.8,161.67 90 top
C27  DNP  [0603-CAP]  40.39,48.26 180 top
C28  10uF 16V  [EIA3216]  254.63,187.45 270 top
C29  0.1uF  [0603-CAP]  257.81,186.06 90 top
C30  4.7uF  [0603-CAP]  161.29,188.98 90 top
C31  0.1uF  [0603-CAP]  158.88,188.98 90 top
C32  0.1uF  [0603-CAP]  261.49,166.75 270 top
C33  0.1uF  [0603-CAP]  175.13,173.61 270 top
C34  0.1uF  [0603-CAP]  178.18,181.74 270 top
C35  0.1uF  [0603-CAP]  273.56,166.75 270 top
C36  0.1uF  [0603-CAP]  127.76,185.8 90 top
C37  0.1uF  [0603-CAP]  118.36,134.75 270 top
C38  47nF  [0603-CAP]  52.96,45.85 270 top
C39  0.1uF  [0603-CAP]  214,179.32 180 top
C40  0.1uF  [0603-CAP]  218.82,170.69 180 top
C41  47nF  [0603-CAP]  52.96,42.29 90 top
C42  100nF  [0603-CAP]  251.46,28.83 0 top
C43  0.1uF  [0603-CAP]  77.09,165.1 270 top
C44  0.1uF  [0603-CAP]  44.32,30.1 180 top
C45  0.1uF  [0603-CAP]  99.69,164.85 270 top
C46  0.1uF  [0603-CAP]  266.83,21.34 270 top
C47  0.1uF  [0603-CAP]  85.85,154.18 270 top
C48  0.1uF  [0603-CAP]  214.38,170.56 0 top
C49  4.7nF  [0603-CAP]  17.14,43.56 0 top
D1  TX  [LED-1206]  140.46,178.82 0 top
D2  RX  [LED-1206]  140.34,182.88 0 top
D3  GN  [LED-1206]  50.55,185.55 180 top
D4  DB2431200L  [SC-110A-POWER_DIODE]  249.56,187.96 90 top
D5  CMSH1-40  [SMB-DIODE]  71.12,132.08 0 top
D6  PWR  [LED-1206]  61.47,153.54 270 top
D8  RX  [LED-1206]  64.77,164.47 270 top
D9  TX  [LED-1206]  60.58,164.47 270 top
D10  RX  [LED-1206]  29.46,32.51 90 top
D11  TX  [LED-1206]  25.27,32.51 90 top
D12  RX  [LED-1206]  91.06,163.45 270 top
D13  TX  [LED-1206]  87,163.58 270 top
D14  RX  [LED-1206]  259.08,21.21 270 top
D15  TX  [LED-1206]  254.89,21.21 270 top
D16  HB  [LED-1206]  69.6,153.54 270 top
D17  USER_LED  [LED-1206]  76.2,153.54 270 top
E1  NAMECHANGE  [NAMECHANGE]  251.84,175.01 90 bottom
E2  1  [MTHOLE4-40]  5.08,5.08 0 top
E3  1  [MTHOLE4-40]  274.32,5.08 0 top
E4  1  [MTHOLE4-40]  22.86,198.12 0 top
E5  1  [MTHOLE4-40]  274.32,198.12 0 top
E6  1  [MTHOLE4-40]  129.41,124.97 0 top
E7  1  [MTHOLE4-40]  144.78,5.08 0 top
E8  NAMECHANGE  [NAMECHANGE]  139.57,173.99 90 top
F2  3.5A  [FUSE_OMNI-BLOCK-154]  275.34,187.32 270 top
FB1  BLM18KG601SN1D  [0603]  155.83,188.98 90 top
FB2  BLM18KG601SN1D  [0603]  72.39,84.45 180 bottom
J10  I2C/!SPI  [1X2]  111.38,164.85 0 top
J11  +5V  [POWER_JACK_PTH]  262.38,202.95 180 top
J12  USBMINI  [USBMINI-TH]  150.75,193.93 0 top
J13  SMB  [SMB-SMD]  37.47,188.21 0 top
J14  SMB  [SMB-SMD]  9.02,188.21 0 top
J15  XBeeCtrl  [2X3]  91.31,179.58 90 top
J16  [2X3SM]  147.83,133.73 0 top
J17  SMA  [SMA-EDGE]  37.47,200.41 90 top
J18  SMA  [SMA-EDGE]  9.02,200.41 90 top
J19  UART/XBee  [2X2SM]  137.67,133.73 0 top
J20  EXT_UART  [PHOENIX1725685-5]  88.39,199.26 0 top
J20A  EXT_UART  [1X05]  93.34,190.5 0 top
J21  KNX DNP  [1X09-SPECIAL]  269.24,31.75 90 top
J22  KNX3V3  [1X03-SPECIAL]  240.41,18.03 0 top
J23  KNX  [1X03-SPECIAL]  240.41,20.57 0 top
J24  KNXGND  [1X03-SPECIAL]  240.41,23.11 0 top
J25  DSBL LCD  [1X2SM]  179.32,160.27 0 top
J27  XBee DNP  [1X07-SPECIAL]  63.88,172.09 0 top
J28  Test Connector  [2X7SM]  150.5,163.83 0 top
J29  TP-J8 DNP  [1X07-SPECIAL]  172.72,137.16 0 top
J30  TP-J9 DNP  [1X09-SPECIAL]  205.1,198.75 0 top
J31  LCD_Test  [1X03-SPECIAL]  71.25,123.83 0 top
J32  HEADER A  [2X13-SM]  237.87,199.01 0 top
J33  HEADER B DNP  [2X10SM]  174.75,129.54 0 top
J34  CAN  [PHOENIX1725669-3]  172.85,198.63 0 top
J34A  CAN DNP  [1X03-SPECIAL]  176.66,191.9 0 top
J35  A0/A1  [2X3SM]  125.09,167.39 0 top
J36  SDA  [1X03-SPECIAL]  114.05,175.39 0 top
J37  I2C/SPI  [PHOENIX1725708-7]  112.39,198.75 0 top
J37A  I2C/SPI DNP  [1X07-SPECIAL]  118.75,190.5 0 top
J38  SCL/SCLK  [1X2]  111.51,170.43 0 top
J40  READER  [1X06]  5.46,33.66 0 top
J41  LpBk B  [2X2SM]  189.61,179.32 0 top
L1  CLF6045T-220M-D  [TDK_CA]  78.74,134.62 180 top
MD1  BeagleBone Black  [BBONE_BK]  192.79,123.7 0 top
MD2  NHD-7.0-800480EF  [NEWHAVEN_LCD_NHD-7.0-800480EF]  56.9,16.13 0 top
MD3  XBEE-2A  [XBEE-2]  66.04,189.23 0 top
MD5  READER  [RADON_RFID_READ]  1.91,150.75 270 top
MD6  KNX-2  [KNX-1]  271.65,55.5 90 top
R1  33  [0603-RES]  268.35,131.95 270 bottom
R2  33  [0603-RES]  268.35,121.92 270 bottom
R3  33  [0603-RES]  265.81,131.95 270 bottom
R4  33  [0603-RES]  265.81,121.92 270 bottom
R5  33  [0603-RES]  263.27,131.95 270 bottom
R6  33  [0603-RES]  263.27,121.92 270 bottom
R7  33  [0603-RES]  260.73,131.95 270 bottom
R8  33  [0603-RES]  260.73,121.92 270 bottom
R9  33  [0603-RES]  258.19,131.95 270 bottom
R10  33  [0603-RES]  258.19,121.92 270 bottom
R11  33  [0603-RES]  255.65,131.95 270 bottom
R12  33  [0603-RES]  255.65,121.92 270 bottom
R13  33  [0603-RES]  253.11,131.95 270 bottom
R14  33  [0603-RES]  253.11,121.92 270 bottom
R15  33  [0603-RES]  250.57,131.95 270 bottom
R16  33  [0603-RES]  250.57,121.92 270 bottom
R17  33  [0603-RES]  248.03,131.95 270 bottom
R18  33  [0603-RES]  248.03,121.92 270 bottom
R19  33  [0603-RES]  245.49,131.95 270 bottom
R20  33  [0603-RES]  245.49,121.92 270 bottom
R21  27  [0603-RES]  150.37,188.09 270 top
R22  27  [0603-RES]  148.08,188.09 270 top
R23  4.7K  [0603-RES]  144.91,181.48 0 top
R24  470  [0603-RES]  144.91,178.82 0 top
R25  4.7K  [0603-RES]  231.01,184.4 270 top
R26  3.74  [0603-RES]  71.75,127.64 270 top
R27  3.74  [0603-RES]  73.66,127.64 270 top
R28  1K  [0603-RES]  76.2,127.38 180 top
R29  20K  [0603-RES]  112.39,151.89 270 top
R30  20K  [0603-RES]  119.51,151.76 270 top
R31  4.7K DNP  [0603-RES]  246.25,39.5 90 top
R32  4.7K  [0603-RES]  237.62,180.09 270 top
R33  4.7K  [0603-RES]  235.33,179.96 270 top
R34  0  [0603-RES]  227.71,131.95 90 top
R35  0 DNP  [0603-RES]  242.95,179.96 90 top
R36  4.7K  [0603-RES]  113.54,181.1 180 top
R37  0 DNP  [0603-RES]  257.56,31.62 0 top
R38  6.04K 1%  [0603-RES]  236.09,39.5 90 top
R39  3.01K 1%  [0603-RES]  236.09,36.32 90 top
R40  0  [0603-RES]  246.63,31.62 180 top
R41  6.04K 1%  [0603-RES]  258.95,39.24 90 top
R42  3.01K 1%  [0603-RES]  258.95,35.94 90 top
R43  4.7K DNP  [0603-RES]  170.18,149.48 90 top
R44  4.7K DNP  [0603-RES]  172.21,149.48 90 top
R45  4.7K  [0603-RES]  174.37,149.48 90 top
R46  4.7K  [0603-RES]  173.1,160.91 270 top
R47  60  [0603-RES]  173.61,186.69 270 top
R48  60  [0603-RES]  175.77,186.69 270 top
R49  0  [0603-RES]  169.67,181.86 0 top
R50  20K  [0603-RES]  153.29,176.91 0 top
R51  0 DNP  [0603-RES]  169.8,184.15 0 top
R52  0 DNP  [0603-RES]  179.96,176.28 180 top
R53  0 DNP  [0603-RES]  158.37,175.64 270 top
R54  0 DNP  [1206]  270.64,187.58 270 top
R55  470  [0603-RES]  49.02,182.25 270 top
R56  0 DNP  [0603-RES]  8.64,49.02 90 top
R57  0  [0603-RES]  7.11,49.02 270 top
R58  1K  [0603-RES]  106.93,192.53 0 top
R59  4.7K  [0603-RES]  232.79,179.96 270 top
R60  0 DNP  [0603-RES]  141.86,174.62 180 top
R61  0 DNP  [0603-RES]  144.91,176.4 180 top
R62  10K DNP  [0603-RES]  156.97,175.64 270 top
R63  10K  [0603-RES]  118.75,166.75 0 top
R64  0.010  [RESIST_4-TERM_VISHAY]  205.1,177.16 90 top
R65  0.010  [RESIST_4-TERM_VISHAY]  25.78,44.45 180 top
R66  33  [0603-RES]  242.95,121.92 270 bottom
R67  0  [0603-RES]  142.11,78.99 90 bottom
R68  10K  [0603-RES]  147.32,75.31 0 bottom
R69  0 DNP  [0603-RES]  147.32,79.5 180 bottom
R70  0  [0603-RES]  207.39,160.78 0 top
R71  0  [0603-RES]  43.18,47.24 90 top
R72  10K  [0603-RES]  131.7,166.88 180 top
R73  4.7K  [0603-RES]  110.24,178.69 90 top
R74  4.7K  [0603-RES]  106.81,172.97 180 top
R75  20K  [0603-RES]  142.89,151 90 top
R76  10K  [0603-RES]  270.26,116.33 180 top
R77  10K  [0603-RES]  96.9,9.78 180 top
R78  10K  [0603-RES]  114.68,9.78 180 top
R79  10K  [0603-RES]  79.25,9.78 180 top
R80  10K  [0603-RES]  62.61,9.78 180 top
R81  10K  [0603-RES]  133.1,9.78 180 top
R82  0 DNP  [0603-RES]  117.47,184.66 90 top
R83  470  [0603-RES]  61.47,157.73 270 top
R84  0  [0805-RES]  55.88,19.94 90 top
R85  4.7K  [0603-RES]  64.9,168.66 270 top
R86  470  [0603-RES]  60.71,168.66 270 top
R87  4.7K  [0603-RES]  32.38,30.99 180 top
R88  470  [0603-RES]  22.35,30.99 0 top
R89  4.7K  [0603-RES]  90.93,167.77 270 top
R90  470  [0603-RES]  87,167.77 270 top
R91  4.7K  [0603-RES]  259.08,25.53 270 top
R92  470  [0603-RES]  254.89,25.53 270 top
R93  4.7K  [0603-RES]  67.31,152.91 90 top
R94  4.7K  [0603-RES]  74.04,152.78 90 top
R95  0  [0805-RES]  59.56,15.11 180 top
R96  0  [0805-RES]  220.22,15.11 180 top
R97  0  [0805-RES]  223.01,19.94 270 top
R98  0  [0603-RES]  81.92,150.11 90 top
R99  20K DNP  [0603-RES]  5.46,38.86 0 top
S1  Power  [EVQ-PAC04M]  208.41,5.08 0 top
S2  Reset  [EVQ-PAC04M]  268.61,111.76 0 top
S3  Up  [EVQ-PAC04M]  93.98,5.08 0 top
S4  Down  [EVQ-PAC04M]  111.76,5.08 0 top
S5  Right  [EVQ-PAC04M]  76.2,5.08 0 top
S6  Left  [EVQ-PAC04M]  59.69,5.08 0 top
S7  Enter  [EVQ-PAC04M]  130.18,5.08 0 top
U1  74HC237  [TSSOP16]  122.68,134.24 0 top
U2  CAT4139T  [TSOT-23-5]  78.74,129.54 270 top
U3  NCV7342  [SOIC08]  174.5,179.58 0 top
U4  SN74LVC2G126  [SM8-TI-A]  104.39,146.05 180 top
U5  FT231XS  [SSOP20-.150]  153.92,182.63 90 top
U6  SN74LVC2G126A  [SM8-TI-A]  112.01,146.05 180 top
U7  SN74LVC2G126A  [SM8-TI-A]  119.89,146.18 180 top
U8  SN74LVC2G126A  [SM8-TI-A]  127.51,146.18 180 top
U9  SN74LVC2G126A  [SM8-TI-A]  135,146.18 180 top
U10  SN74LVC2G126A  [SM8-TI-A]  142.49,146.05 180 top
U11  SC16IS740IPW  [TSSOP16]  121.67,180.85 180 top
U12  CAT24C256WI-GT3  [SO08]  173.74,155.19 0 top
U13  SN74LVC2G126  [SM8-TI-A]  251.97,31.37 90 top
U14  ADG4612  [TSSOP16]  268.22,167.39 270 top
U15  ADG4612  [TSSOP16]  256.03,167.39 270 top
U16  SN74LVC2G126A  [SM8-TI-A]  148.08,174.24 90 top
U17  IL712S  [SOIC08]  49.4,44.07 180 top
U18  INA225  [MSOP8]  205.49,164.34 270 top
U19  INA225  [MSOP8]  40.51,43.05 0 top
U20  TPS22958  [MSOP8-POWERPAD]  12.57,43.43 270 top
U21  SN74LVC2G126  [SM8-TI-A]  74.55,166.37 180 top
U22  SN74LVC2G126  [SM8-TI-A]  41.4,32 180 top
U23  SN74LVC2G126  [SM8-TI-A]  97.16,165.99 180 top
U24  SN74LVC2G126  [SM8-TI-A]  264.41,22.61 180 top
U25  SN74LVC2G126  [SM8-TI-A]  83.31,155.45 180 top
U$3  [HERMES]  153.03,5.21 0 top
U$62  [RFMLOGO3B]  26.04,11.3 0 top
U$80  [SERNUM]  263.65,6.6 180 top

## Tracks (layer width: path | path; a pad name or v marks a point on that pad's centre or on a via)
!CTS  (via drill 0.6)
  Top 0.254: U5.9 159.64,184.85 v159.64,184.78
  SI1 0.254: v159.64,184.78 146.81,184.78 146.94,190.88 141.22,190.88 141.22,197.1 100.33,197.1 100.33,179.71 92.58,179.71 J15.3
!DTR  (via drill 0.6)
  Top 0.254: U5.1 157.99,179.77 v157.99,178.82
  SI1 0.254: v157.99,178.82 141.6,178.82 141.6,188.34 139.83,188.34 139.83,195.45 101.85,195.45 101.85,174.75 v98.3,174.75
  SI2 0.254: v98.3,174.75 98.3,182.12 J15.5
!IRQ  (via drill 0.6)
  Top 0.254: J37.4 J37A.4 120.02,184.91 | U11.7 120.02,183.7 120.02,184.91 | R82.1 118.49,183.76 118.49,184.91 120.02,184.91 | R58.2 v109.86,192.53
  SI2 0.254: v109.86,192.53 120.02,192.53 J37A.4
!LCD_BACKLIGHT  (via drill 0.6)
  Top 0.254: U2.4 84.33,128.59 84.33,121.03 147.32,121.03 147.32,123.32 192.15,123.32 192.15,136.65 213.36,136.65 213.36,151.76 v214.5,151.76 | MD1.~14 227.71,166.12 222,166.12 222,153.67 v224.03,152.91
  SI1 0.254: v224.03,152.91 214.5,152.91 v214.5,151.76
!RTS  (via drill 0.6)
  Top 0.254: 157.19,180.34 U5.2 159.38,180.4 v159.38,179.83
  SI1 0.254: v159.38,179.83 143.64,179.83 143.64,189.48 140.59,189.48 140.59,196.34 101.09,196.34 101.09,177.04 J15.1
+5V
  Top 0.254: J11.1 262.38,189.61 | 275.22,191.01 F2.1 272.17,190.89 R54.1
  Top 3.81: 262.38,189.61 263.78,191.01 275.22,191.01
A0/CS  (via drill 0.6)
  Top 0.254: J37A.5 J37.5 122.56,200.41 129.54,200.41 129.54,185.8 123.32,185.8 123.32,183.7 | U11.2 123.32,183.7 | 123.32,183.7 123.32,182.37 v131.44,182.37 | v126.36,176.78 126.36,167.39 125.09,167.39 J35.3 125.09,163.32 v130.43,163.32
  SI2 0.254: v126.36,176.78 127.64,176.78 127.64,181.23 131.44,181.23 v131.44,182.37 | v130.43,163.32 141.6,163.32 J28.1
A1/SI  (via drill 0.6)
  Top 0.254: J37.6 J37A.6 125.09,186.82 122.68,186.82 122.68,183.7 | U11.3 122.68,183.7 | 122.68,183.7 122.68,181.86 129.67,181.86 v129.67,165.35 | v135.76,164.21 135.76,163.83 144.15,163.83 J28.3
  SI2 0.254: v135.76,164.21 134.24,164.21 134.24,165.48 v129.67,165.35 129.29,165.48 129.29,167.39 125.09,167.39 J35.4
AGND  (via drill 0.6)
  Top 0.254: v188.98,137.16 212.09,137.16 212.09,153.42 213.11,153.42 213.11,161.42 v213.23,161.42
  SI2 0.254: v251.84,179.07 v251.84,180.97 | J33.8 170.94,135 188.98,135 v188.98,137.16
  Bottom 0.254: E1.2 v251.84,179.07 | v251.84,180.97 249.81,180.97 249.81,181.86 241.68,181.86 | 241.68,181.86 J32.15 | 241.68,181.86 241.68,169.54 239.9,169.54 239.9,160.4 213.23,160.4 v213.23,161.42
AIN0
  Top 0.254: U14.7 262.51,165.71 262.51,171.07 262,171.83 262,175.13 MD1.~39
AIN1
  Top 0.254: MD1.~40 259.46,173.86 259.46,175.13 256.92,175.13 256.92,170.69 256.03,170.69 256.03,165.74 259.08,165.74 U15.10
AIN2  (via drill 0.6)
  Top 0.254: v271.91,176.53 271.91,171.32 268.1,171.32 268.1,165.74 271.27,165.74 U14.10
  Bottom 0.254: MD1.~37 258.19,178.31 271.91,178.31 v271.91,176.53
AIN3
  Top 0.254: MD1.~38 257.81,173.86 257.81,169.29 258.19,168.91 259.08,168.91 U15.15
AIN4  (via drill 0.6)
  Top 0.254: MD1.~33 253.11,178.82 270.64,178.82 v270.64,179.45 | v270.64,172.85 270.64,171.83 266.7,171.83 266.7,168.91 266.64,168.91 U14.2
  SI1 0.254: v270.64,179.45 v270.64,172.85
AIN4_SW  (via drill 0.6)
  Top 0.254: U14.3 263.65,168.31 v263.65,168.4
  SI1 0.254: v263.65,168.4 263.52,168.4 263.52,170.56 254.38,170.56 254.38,179.83 260.86,179.83 260.86,181.1 265.68,181.1 265.68,202.31 237.74,202.31 237.74,199.01 231.52,199.01 J32.7
AIN5
  Top 0.254: MD1.~36 255.65,171.96 254.51,171.96 254.51,168.91 253.18,168.91 U15.2
AIN5_SW
  Top 0.254: U15.3 249.3,168.31 249.3,181.86 240.92,181.86 240.92,193.42 234.06,193.42 J32.9
AIN6
  Top 0.254: MD1.~35 255.65,178.31 272.92,178.31 272.92,170.81 270,170.81 270,169.22 270.26,168.96 U14.15
BBB_I-SENSE  (via drill 0.6)
  Top 0.254: R70.2 209.8,160.78 C26.1 209.8,160.66 212.34,160.66 212.34,163.07 v215.39,163.07 | U15.14 257.3,168.31 v257.3,168.15
  SI1 0.254: v257.3,168.15 256.03,168.15 256.03,161.67 215.39,161.67 v215.39,163.07
BBB_I-SENSE+
  Top 0.254: R64.4 198.37,181.67 198.37,168.66 203.24,168.66 U18.1
BBB_I-SENSE-
  Top 0.254: R64.3 199.9,172.16 199.9,169.16 207.74,169.16 U18.8
BRIDGE_CLK  (via drill 0.5, 0.6)
  Top 0.254: R35.2 243.44,180.73 C12.1 244.22,179.45 244.22,165.1 232.03,165.1 232.03,162.94 227.46,162.94 227.46,143.38 v226.06,143.38 226.06,134.62 227.71,134.62 R34.2 | U11.15 123.19,177.8 123.19,176.66 124.59,176.66 v124.59,175.9
  Bottom 0.254: v124.59,175.9 124.59,173.61 139.45,173.61 139.45,169.42 162.81,169.42 162.81,143.38 v226.06,143.38
BRIDGE_RX  (via drill 0.6)  (1 unrouted)
  Top 0.254: U7.3 119.51,148.08 R30.2 119.51,150.88 121.67,150.88 v121.67,153.92 | 121.92,177.8 121.92,176.4 121.79,176.4 121.79,172.09 v121.67,172.09 118.75,172.09 118.75,165.48 v121.67,162.05 | v99.82,169.8 97.48,169.8 U23.2
  SI1 0.254: v121.67,172.09 120.52,172.09 120.52,174.62 117.86,174.62 117.86,172.21 118.49,172.21 118.49,169.42 115.95,169.42 115.95,161.42 101.09,161.42 101.09,168.53 99.82,168.53 v99.82,169.8
  Bottom 0.254: v121.67,162.05 v121.67,153.92
BRIDGE_TX  (via drill 0.6)  (1 unrouted)
  Top 0.254: U11.12 121.28,173.1 v119.13,173.1 | U23.5 96.14,164.09 96.14,161.93 v94.49,161.93 | v122.56,149.48 120.21,149.48 U7.2
  SI1 0.254: v94.49,161.93 94.49,160.66 119.13,160.66 | 119.13,160.66 116.71,161.42 116.71,168.91 119.13,168.91 v119.13,173.1 | 119.13,160.66 119.13,149.99 122.56,149.99 v122.56,149.48
CANH
  Top 0.254: J34.1 J34A.1 172.85,189.61 172.09,189.61 172.09,185.79 R47.2 173.61,182.65 U3.7
CANL
  Top 0.254: J34.2 J34A.2 175.39,189.1 178.44,189.1 178.44,185.79 R48.2 175.13,185.8 U3.6
CBUS2  (via drill 0.6)
  Top 0.254: v152.27,174.75 152.2,173.92 U16.2 | U5.10 157.23,185.48 157.23,186.56 162.69,186.56 v162.69,186.06
  SI1 0.254: v152.27,174.75 152.27,176.4 162.69,176.4 v162.69,186.06
CBUS3  (1 unrouted)
  Top 0.254: U5.19 152.27,180.4 152.27,178.94 151.38,178.94 151.38,174.5 149.98,174.5
CBUS3_SW
  Top 0.254: R61.2 141.99,176.4 141.99,176.66 139.57,176.66 E8.1
DCAN1_RX  (via drill 0.6)
  Top 0.254: 176.4,177.16 U3.4 176.4,176.29 | R52.2 176.4,176.29 | 176.4,176.29 179.58,176.29 179.58,172.72 179.58,172.59 179.58,164.85 180.85,164.85 180.97,164.08 | J33.12 176.02,133.35 186.18,133.35 186.18,164.08 180.97,164.08 | v180.85,164.08 180.97,164.08
  SI1 0.254: MD1.~24 239.01,173.86 239.01,169.93 237.11,169.93 v237.11,168.53
  SI2 0.254: v180.85,164.08 196.47,164.08 196.47,161.42 200.66,161.42 200.66,159.38 237.11,159.38 v237.11,168.53
DCAN1_TX  (via drill 0.6)
  Top 0.254: U3.1 172.59,166.75 176.91,166.75 176.91,162.94 v182.37,162.94 185.55,162.94 185.55,133.99 173.48,133.99 J33.10 | MD1.~26 241.68,173.86 v241.68,168.02
  SI2 0.254: v182.37,162.94 195.45,163.07 195.45,160.27 199.9,160.27 199.9,158.62 241.68,158.62 v241.68,168.02
DOWN_BUT  (via drill 0.6)
  Top 0.254: S4.2 115.58,7.34 R78.1 115.7,9.78 | v218.95,166.24 219.96,166.24 219.96,133.35 195.58,133.35 195.58,107.95 186.82,107.95 186.82,58.04 122.68,58.04 122.68,66.93 65.53,66.93 65.53,12.19 70.74,12.19 70.74,11.05 107.95,11.05 S4.1
  Top 0.406: S4.1 S4.2
  SI1 0.254: MD1.~27 244.22,176.4 244.22,167.26 242.7,167.26 242.7,165.86 231.27,165.86 231.27,167.26 v226.44,167.26
  Bottom 0.254: v226.44,167.26 226.44,166.24 v218.95,166.24
EEPROM-WP  (via drill 0.6)
  Top 0.254: R46.2 U12.7 173.1,155.96 167.26,155.96 167.26,162.05 v160.02,162.05
  Bottom 0.254: J28.13 160.02,162.56 v160.02,162.05
ENTER_BUT
  Top 0.254: S7.2 R81.1 136.14,9.78 136.14,10.54 180.97,10.54 180.97,4.95 225.81,4.95 225.81,110.24 232.79,110.24 MD1.18 | 133.99,9.78 133.99,7.62 126.36,7.62 S7.1
  Top 0.406: R81.1 133.99,9.78
EXT_UART_RX
  Top 0.254: J20A.4 96.01,190.5 J20.4 96.01,200.53 96.14,200.66 100.2,200.66 100.84,200.03 100.84,183.51 103.38,180.97 103.38,165.48 111.51,151.26 112.13,151.26 R29.2 | U6.2 112.34,150.45 R29.2 | R29.2 115.95,150.99 115.95,155.45 113.41,155.45 113.41,158.24 154.31,158.24 J28.11
EXT_UART_TX  (via drill 0.6)
  Top 0.254: J20A.5 98.55,190.5 | 98.55,190.5 J20.5 | 98.55,190.5 98.55,185.17 102.87,180.72 102.87,165.35 107.95,156.46 107.56,156.18 | 107.56,156.18 107.57,156.08 108.71,154.56 108.97,154.43 110.49,151.89 111.69,150.11 U6.3 | v124.33,160.78 124.33,160.66 125.48,160.66 125.48,158.88 151.76,158.88 J28.9 | v108.08,155.32 107.95,155.45 107.56,156.18
  SI2 0.254: v124.33,160.78 116.33,160.78 116.33,158.5 109.98,158.5 109.98,155.07 108.08,155.07 v108.08,155.32
GND  (via drill 0.6, 1.1)
  Top 0.254: C1.2 148.77,191.2 J12.5 | C30.2 161.42,190 161.42,191.64 161.29,191.77 v161.42,191.77 C3.2 159,191.77 159,190 C31.2 | U5.6 157.19,182.88 v160.02,182.88 C15.2 | U5.16 150.66,182.25 v148.08,182.25 | U16.4 v149.98,176.53 v149.99,176.53 | C21.1 v155.7,172.21 | C9.1 131.57,145.68 v131.57,145.16 | C10.1 138.81,145.81 v138.81,146.05 | C11.1 146.43,145.81 v146.43,146.05 | v140.21,148.59 140.72,148.34 U10.4 | v132.72,148.59 132.72,147.96 134.03,147.96 U9.4 | v125.35,148.59 125.35,147.96 126.53,147.96 U8.4 | v123.57,145.16 123.57,145.41 122.17,145.41 C8.1 | v115.7,145.54 115.7,145.41 114.43,145.41 C7.1 | v117.73,148.59 117.73,147.96 118.91,147.96 U7.4 | v109.86,148.59 109.86,147.96 U6.4 | v102.23,148.59 102.23,147.96 U4.4 | v108.08,146.05 108.08,145.41 106.81,145.41 C4.1 | v124.97,133.22 124.97,131.39 U1.8 125.01,130.18 123.06,130.18 U1.5 U1.4 | C37.2 v118.36,132.59 | J37A.7 127.76,190.5 | 127.76,198.75 J37.7 J37A.7 | 177.93,198.75 J34A.3 177.93,190.75 179.32,190.75 179.32,187.71 C14.2 | C22.2 R42.1 257.31,33.4 v255.52,33.4 255.52,32.34 U13.4 | C23.2 R39.1 v236.09,34.04 | C42.2 v253.62,28.83 | C5.2 83.17,131.81 80.9,129.54 U2.2 71.88,129.54 | 71.88,129.54 71.12,129.54 v70.36,127.64 69.1,127.64 C6.2 | R27.1 R26.1 71.75,129.41 71.88,129.54 | v40.51,36.45 v40.5,36.45 C25.1 40.19,38.1 U19.2 U19.7 U19.6 U19.5 | C27.2 v39.5,49.66 | C44.1 v46.99,30.1 | C41.2 v51.05,43.05 | v39.24,34.04 40.43,34.04 U22.4 | D6.C v61.47,150.24 | C47.1 v85.85,156.46 | U25.4 81.28,157.35 v81.28,158.62 81.28,165.99 C43.1 v77.09,167.64 | U21.4 72.39,168.27 v72.39,169.04 | U23.4 95.12,167.89 v95.12,168.78 | C45.1 v99.69,167.13 | C46.1 v266.83,23.62
  Top 0.254: v262.25,25.4 262.25,24.38 263.44,24.38 U24.4 | 203.24,164.72 U18.2 | U18.2 U18.7 U18.5 | C26.2 211.2,162.57 v211.2,162.69 | v199.77,164.59 C24.1 201.17,164.66 U18.2 | C12.2 v247.9,179.45 | C32.2 v261.49,164.59 | v273.56,164.59 C35.2 | U14.5 267.08,167 v267.08,167.26 267.08,167.64 U14.4 | U15.4 254.89,167.64 v254.89,167.26 254.64,167.01 U15.5 | U3.2 v173.86,174.12 173.86,172.85 175.13,172.85 C33.2 | v168.66,180.34 168.77,180.34 R49.1 | v178.18,179.45 C34.2 | U11.9 119.34,175.39 J36.3 115.32,178.18 112.64,178.18 R36.2 | C36.2 127.64,186.7 J37A.7 | v170.31,161.93 171.83,161.93 C13.2 | MD1.~1 213.09,176.4 C39.2 | v51.18,190.37 v51.17,190.37 C17.2 C16.2 | U17.5 v47.5,43.05 | C49.2 18.03,42.8 15.62,42.8 15.62,43.05 14.82,43.05 U20.6 12.57,43.11 U20.10 | U12.4 v178.05,152.58 | C2.2 v154.56,190.63
  Top 0.508: C19.2 12.7,39.5 v12.7,41.02 12.71,39.5 C18.2
  Top 0.61: C29.2 257.68,186.96 J11.3 | J11.3 260.68,195.25 J11.2 | D4.A 251.64,192.25 J11.3 | C28.C 257.68,191.77 J11.3 | R55.2 49.02,177.8 55.04,177.8 MD3.10 | v46.74,163.96 46.74,190.37 v51.18,190.37
  Top 0.813: C48.2 v216.53,170.56 217.92,170.56 C40.2
  SI1 0.254: v77.09,167.64 72.52,167.64 72.52,169.04 v72.39,169.04 72.77,169.04 | v178.05,152.58 J25.1
  SI1 0.61: v51.18,190.37 52.07,190.37 52.07,177.8 55.04,177.8 MD3.10
  SI2 0.61: 55.04,177.55 MD3.10
  SI2 0.813: J27.7 72.77,173.74 56.01,173.74 56.01,177.55 55.04,177.55
  Bottom 0.203: v84.58,80.52 MD2.14 | 79.12,84.07 79.12,84.58 79.63,84.58 | 79.63,84.58 80.14,84.58 80.14,83.82 | 79.63,84.58 v79.63,85.47
  Bottom 0.254: MD2.14 MD2.13 | v89.15,80.52 MD2.23 MD2.22 MD2.21 | MD2.36 v95.63,80.52 MD2.42 | v92.2,80.52 MD2.29 | MD2.7 MD2.6 MD2.5 | MD2.5 80.14,80.52 v79.12,80.52 MD2.41 C20.2 | MD2.3 79.12,84.07 | 80.14,83.82 MD2.5 | MD2.~7 v131.82,72.39 v131.83,72.39 | MD2.~2 138.97,71.66 v138.81,71.5 | MD2.~8 149.23,72.39 v149.22,72.64 | E4.1 22.73,198.12 v22.73,177.04 | MD1.~34 251.84,173.86 E1.1
  other vias: 81.92,130.56 75.31,129.54 12.57,45.72 7.75,77.6 10.29,77.6 12.83,77.6 15.37,77.6 17.91,77.6 21.72,77.6 24.26,77.6 26.8,77.6 29.34,77.6 31.88,77.6 34.42,77.6 7.75,80.14 10.29,80.14 12.83,80.14 15.37,80.14 17.91,80.14 21.72,80.14 24.26,80.14 26.8,80.14 29.34,80.14 31.88,80.14 34.42,80.14 7.75,82.68 10.29,82.68 12.83,82.68 15.37,82.68 17.91,82.68 21.72,82.68 24.26,82.68 26.8,82.68 29.34,82.68 31.88,82.68 34.42,82.68 7.75,85.22 10.29,85.22 12.83,85.22 15.37,85.22 17.91,85.22 21.72,85.22 24.26,85.22 26.8,85.22 29.34,85.22 31.88,85.22 34.42,85.22 7.75,87.76 10.29,87.76 12.83,87.76 15.37,87.76 17.91,87.76 21.72,87.76 24.26,87.76 26.8,87.76 29.34,87.76 31.88,87.76 34.42,87.76 7.75,90.3 10.29,90.3 12.83,90.3 15.37,90.3 17.91,90.3 21.72,90.3 24.26,90.3 26.8,90.3 29.34,90.3 31.88,90.3 34.42,90.3 7.75,92.84 10.29,92.84 12.83,92.84 15.37,92.84 17.91,92.84 21.72,92.84 24.26,92.84 26.8,92.84 29.34,92.84 31.88,92.84 34.42,92.84 7.75,95.38 10.29,95.38 12.83,95.38 15.37,95.38 17.91,95.38 21.72,95.38 24.26,95.38 26.8,95.38 29.34,95.38 31.88,95.38 34.42,95.38 7.75,97.92 10.29,97.92 12.83,97.92 15.37,97.92 17.91,97.92 21.72,97.92 24.26,97.92 26.8,97.92 29.34,97.92 31.88,97.92 34.42,97.92 7.75,100.46 10.29,100.46 12.83,100.46 15.37,100.46 17.91,100.46 21.72,100.46 24.26,100.46 26.8,100.46 29.34,100.46 31.88,100.46 34.42,100.46 7.75,103 10.29,103 12.83,103 15.37,103 17.91,103 21.72,103 24.26,103 26.8,103 29.34,103 31.88,103 34.42,103 7.75,105.54 10.29,105.54 12.83,105.54 15.37,105.54 17.91,105.54 21.72,105.54 24.26,105.54 26.8,105.54 29.34,105.54 31.88,105.54 34.42,105.54 15.37,108.08 17.91,108.08 21.72,108.08 24.26,108.08 26.8,108.08 29.34,108.08 31.88,108.08 34.42,108.08 15.37,110.62 17.91,110.62 21.72,110.62 24.26,110.62 26.8,110.62 29.34,110.62 31.88,110.62 34.42,110.62 15.37,113.16 17.91,113.16 21.72,113.16 24.26,113.16 26.8,113.16 29.34,113.16 31.88,113.16 34.42,113.16 7.75,115.7 10.29,115.7 12.83,115.7 15.37,115.7 17.91,115.7 21.72,115.7 24.26,115.7 26.8,115.7 29.34,115.7 31.88,115.7 34.42,115.7 7.75,118.24 10.29,118.24 12.83,118.24 15.37,118.24 17.91,118.24 21.72,118.24 24.26,118.24 26.8,118.24 29.34,118.24 31.88,118.24 34.42,118.24 7.75,120.78 10.29,120.78 12.83,120.78 15.37,120.78 17.91,120.78 21.72,120.78 24.26,120.78 26.8,120.78 29.34,120.78 31.88,120.78 34.42,120.78 7.75,123.32 10.29,123.32 12.83,123.32 15.37,123.32 17.91,123.32 21.72,123.32 24.26,123.32 26.8,123.32 29.34,123.32 31.88,123.32 34.42,123.32 7.75,125.86 10.29,125.86 12.83,125.86 15.37,125.86 17.91,125.86 21.72,125.86 24.26,125.86 26.8,125.86 29.34,125.86 31.88,125.86 34.42,125.86 7.75,128.4 10.29,128.4 12.83,128.4 15.37,128.4 17.91,128.4 21.72,128.4 24.26,128.4 26.8,128.4 29.34,128.4 31.88,128.4 34.42,128.4 7.75,130.94 10.29,130.94 12.83,130.94 15.37,130.94 17.91,130.94 21.72,130.94 24.26,130.94 26.8,130.94 29.34,130.94 31.88,130.94 34.42,130.94 7.75,133.48 10.29,133.48 12.83,133.48 15.37,133.48 17.91,133.48 21.72,133.48 24.26,133.48 26.8,133.48 29.34,133.48 31.88,133.48 34.42,133.48 7.75,136.02 10.29,136.02 12.83,136.02 15.37,136.02 17.91,136.02 21.72,136.02 24.26,136.02 26.8,136.02 29.34,136.02 31.88,136.02 34.42,136.02 7.75,138.56 10.29,138.56 12.83,138.56 15.37,138.56 17.91,138.56 21.72,138.56 24.26,138.56 26.8,138.56 29.34,138.56 31.88,138.56 34.42,138.56 7.75,141.1 10.29,141.1 12.83,141.1 15.37,141.1 17.91,141.1 21.72,141.1 24.26,141.1 26.8,141.1 29.34,141.1 31.88,141.1 34.42,141.1 7.75,143.64 10.29,143.64 12.83,143.64 15.37,143.64 17.91,143.64 21.72,143.64 31.88,143.64 34.42,143.64 3.94,175.39 3.94,171.58 3.94,160.15 40.77,174.12 5.21,19.18 17.91,5.21 36.96,5.21 251.59,5.21 273.18,62.36 273.18,94.11 273.18,118.24 273.18,142.37
  pour GND: 2.54,2.54 2.54,177.8 43.18,177.8 43.18,165.1 83.82,165.1 83.82,200.66 276.86,200.66 276.86,2.54
  pour Bottom: 1.27,1.27 1.4,177.93 3.43,177.8 3.3,177.67 43.18,177.67 43.18,164.97 81.66,164.97 81.79,165.1 83.95,165.1 83.95,201.93 278.13,201.93 278.13,1.27
  pour Top (rank 2): 1.27,1.27 1.27,177.93 43.18,177.67 43.18,164.97 83.95,165.1 83.95,201.93 278.13,201.93 278.13,1.27
  cutout Top: 72.39,12.06 177.16,12.06 177.16,43.81 102.23,43.81 102.23,64.14 72.39,64.14
  cutout Bottom: 72.39,12.06 177.16,12.06 177.16,43.81 102.23,43.81 102.23,64.14 72.39,64.14
  cutout GND: 72.39,12.06 177.16,12.06 177.16,43.81 102.23,43.81 102.23,64.14 72.39,64.14
GND_RF  (6 unrouted)
  Top 0.254: J17.3 40.39,200.91 40.39,197.99
  Top 0.61: J13.2 J13.3
GPIO0_7  (via drill 0.6)
  Top 0.254: v19.56,54.74 7.11,54.74 R57.1 | E8.2 139.57,172.34 v137.54,172.34
  SI1 0.254: v19.56,54.74 19.18,175.77 56.39,175.77 56.39,174.12 80.39,174.12 80.39,172.85 106.3,172.85 106.3,188.09 133.86,188.09 133.86,193.8 v137.54,193.8 v137.54,172.34
  SI2 0.254: J32.21 249.43,195.45 | 249.43,195.45 v216.15,195.45 | 249.43,195.45 257.94,195.45 257.94,198.25 267.72,198.25 267.72,180.59 262,180.59 262,175.01 263.27,175.01 MD1.~42
  Bottom 0.254: v216.15,195.45 213.87,195.45 213.87,193.55 193.04,193.55 193.04,199.9 160.15,199.9 160.15,196.34 137.54,196.34 v137.54,193.8
GPIO0_20  (via drill 0.6)
  Top 0.254: R60.2 v140.97,175.77
  SI2 0.254: v140.97,175.77 141.1,175.77 141.1,176.91 148.84,176.91 148.84,175.51 151.26,175.51 151.64,175.9 182.12,175.9 182.12,189.1 196.85,189.1 196.85,195.96 201.29,195.96 201.29,201.55 232.79,201.55 232.79,196.22 248.03,196.22 248.03,199.01 251.84,199.01 J32.23 251.84,196.22 257.18,196.22 257.18,198.88 268.61,198.88 268.61,179.83 263.27,179.83 MD1.~41
GPIO0_23  (via drill 0.6)
  Top 0.254: MD1.13 R34.1 227.71,131.06 224.79,131.06 v224.79,141.6
  SI2 0.254: J29.2 168.91,141.1 224.79,140.97 v224.79,141.6
GPIO1_12  (via drill 0.6)
  Top 0.254: v180.86,179.07 R52.1 180.97,176.28 180.97,165.86 186.82,165.86 186.82,132.08 v191.26,132.08
  SI2 0.254: J32.14 239.14,199.01 235.33,199.01 235.33,202.18 198.75,202.18 198.75,196.6 196.22,196.6 196.22,189.74 180.86,189.74 v180.86,179.07 | v191.26,132.08 223.9,132.08 223.9,127 225.17,127 MD1.12
GPIO1_13  (via drill 0.6)
  Top 0.254: R51.1 169.04,184.15 v169.04,186.31 | v119,186.06 119,185.55 117.47,185.55 R82.2 | v191.39,191.9 194.18,192.91 211.46,192.91 v211.46,195.2 | v223.52,142.37 223.52,129.79 225.17,129.79 MD1.11
  SI1 0.254: v169.04,186.31 169.04,188.59 170.69,188.59 170.69,188.98 181.23,188.98 181.23,191.64 191.13,191.64 v191.39,191.9 | J32.12 236.6,202.18 214,202.06 214,195.2 v211.46,195.2 v211.58,190.63 | v197.74,187.2 194.69,187.2 194.69,149.99 221.87,149.99 221.87,142.37 v223.52,142.37
  SI2 0.254: v169.04,186.31 163.96,186.31 163.96,187.32 119,187.32 v119,186.06 | v211.58,190.63 197.74,190.63 v197.74,187.2
GPIO1_14  (via drill 0.6)
  Top 0.254: R37.2 259.46,31.62 v259.46,33.4 | J32.19 246.89,197.74 246.89,195.83 258.7,195.83 258.7,198.5 270.38,198.5 270.38,194.31 278.51,194.31 278.51,121.92 238.51,121.92 v238.51,121.03 | v53.34,23.5 53.34,4.7 136.91,4.7 136.91,9.27 180.09,9.27 180.09,3.94 232.79,3.94 232.79,14.99 249.94,14.99 v249.94,24 | v73.15,148.84 81.92,148.84 R98.1
  SI2 0.254: v249.94,24 252.35,24.13 252.35,27.18 259.46,27.18 v259.46,33.4
  Bottom 0.254: v259.46,33.4 256.79,33.4 256.79,34.8 252.6,34.8 252.6,72.14 238.51,72.14 238.51,111.89 | 238.51,111.89 230.25,111.89 MD1.16 | 238.51,111.89 v238.51,121.03 | v53.34,23.5 55.5,23.5 55.5,148.84 v73.15,148.84
GPIO1_15  (via drill 0.6)
  Top 0.254: R40.2 245.49,31.62 v245.49,34.67 | J32.17 244.22,195.45 244.35,195.33 259.33,195.33 259.33,197.74 269.88,197.74 269.88,193.8 278,193.8 277.88,131.83 230.25,131.83 MD1.15
  Bottom 0.254: v245.49,34.67 247.52,34.67 247.52,71.37 237.74,71.37 237.74,110.87 228.85,110.87 228.85,126.87 230.25,126.87 MD1.15
GPIO2_3  (via drill 0.6)
  Top 0.254: J32.8 231.52,202.06 211.46,202.06 211.46,196.85 212.72,195.58 212.72,192.02 193.8,192.02 v192.66,190.88 | v159.77,174.12 159.13,174.24 R53.2
  SI1 0.254: 192.66,189.36 192.66,189.23 | 192.66,189.23 192.66,178.18 193.8,178.18 193.8,138.05 v195.2,138.05 | v159.77,174.12 169.93,174.12 169.93,188.09 181.86,188.09 181.86,190.88 v192.66,190.88 192.79,190.5 192.66,189.23
  Bottom 0.254: v195.2,138.05 218.82,138.05 218.82,126.87 220.09,126.87 MD1.8
GPIO2_5  (via drill 0.6)
  Top 0.254: J32.10 232.79,200.28 232.79,199.01 221.49,199.01 221.49,194.18 221.62,194.18 221.62,179.45 223.9,179.45 v223.9,168.4 | v224.28,91.31 199.64,91.31 199.64,131.44 222.63,131.44 | 222.63,131.44 MD1.9 | v223.01,163.19 v223.01,155.45 | v224.03,149.48 222.63,149.48 222.63,131.44
  SI2 0.254: v223.9,168.4 223.01,168.4 v223.01,163.19 | v223.01,155.45 223.01,150.24 v224.03,149.48
  Bottom 0.254: v224.28,91.31 182.12,91.31 R69.2
I2C1_SCL
  Top 0.254: MD1.~17 R59.2
  SI2 0.254: MD1.~17 231.65,176.4 231.65,176.53 231.52,176.53 231.52,178.69 229.11,178.69 229.11,183.51 188.34,183.51 J41.2
  Bottom 0.254: J32.16 241.68,199.01 240.41,199.01 240.41,195.33 240.92,195.33 240.92,183.84 234.06,183.84 234.06,177.67 MD1.~17
I2C1_SDA  (via drill 0.6)
  Top 0.254: v238.89,186.06 234.19,186.06 234.19,183.51 231.27,183.51 R25.2 231.02,178.42 231.52,178.05 231.52,175.13 232.79,175.13 MD1.~18
  SI2 0.254: MD1.~18 232.79,175.13 226.44,175.13 226.44,182.63 190.88,182.63 J41.4 | v242.95,186.06 v238.89,186.06
  Bottom 0.254: J32.18 242.95,200.28 v242.95,186.06
I2C2-SCL  (via drill 0.6)
  Top 0.254: J30.4 202.56,196.22 187.07,196.22 v186.31,195.83 | v167.77,195.83 165.1,195.83 165.1,165.35 v160.27,165.35 | v174.37,163.19 U12.6 | R33.2 MD1.~19
  SI1 0.254: v186.31,195.83 v167.77,195.83 167.64,195.83 | v160.27,165.35 160.27,163.19 v174.37,163.19
  SI2 0.254: MD1.~19 234.06,176.4 234.06,179.96 229.87,179.96 229.87,191.13 226.57,191.13 226.57,193.04 202.56,193.04 J30.4
  Bottom 0.254: MD2.~3 140.08,75.24 140.08,80.52 159,151.59 161.04,151.59 161.04,163.58 160.27,163.58 v160.27,165.35
I2C2-SDA  (via drill 0.5, 0.6)
  Top 0.254: MD1.~20 236.6,175.13 236.6,178.31 | 236.6,178.31 237.62,178.94 R32.2 | J30.7 210.19,193.55 192.28,193.55 v190.12,192.91 | v168.15,189.23 167,189.23 167,166.12 171.07,166.12 | 171.07,166.12 175.64,166.12 U12.5 | v171.07,164.85 171.07,166.12 | 236.6,178.31 236.6,182.25 235.97,182.25 v235.97,184.99
  SI1 0.254: v190.12,192.91 180.59,192.91 180.59,189.87 169.54,189.87 169.54,189.23 v168.15,189.23 | v161.67,164.47 171.07,164.47 v171.07,164.85
  Bottom 0.254: MD2.~4 140.97,80.89 159.51,151.13 161.67,151.13 v161.67,164.47 | v235.97,184.99 235.97,195.45 218.57,195.45 218.57,196.6 210.19,196.6 J30.7
I2C/!SPI  (via drill 0.6)
  Top 0.254: U11.8 119.38,183.7 119.38,182.75 116.84,182.75 v116.84,182.37 | v114.43,183.01 v114.44,183.01 114.44,182.12 | 114.44,182.12 R36.1 | v114.81,168.91 114.81,172.97 111.51,172.97 111.51,182.12 114.44,182.12
  SI1 0.254: v116.84,182.37 116.84,183.01 v114.43,183.01 | J10.2 114.81,164.85 v114.81,168.91
KNX_3.3V
  Top 0.254: R38.2 MD6.23 234.44,44.45 234.44,46.1 235.46,47.12 249.81,47.12 250.06,46.86 250.06,40.77 247.78,38.48 246.25,38.48 | 246.25,38.48 244.35,38.48 244.35,18.03 J22.3 J22.2 J22.1 | 246.25,38.48 R31.1
  SI1 0.254: J21.8 236.09,39.37 MD6.23
KNX_3.3V_DIV  (via drill 0.6)
  Top 0.254: R39.2 R38.1 | R39.2 C23.1 | U15.11 257.3,166.36 v257.3,166.62 | v232.03,37.34 236.09,37.34 R39.2
  SI2 0.254: v257.3,166.62 257.18,161.67 277.37,161.67 277.37,54.1 232.03,54.1 v232.03,37.34
KNX_ANAOUT
  Top 0.254: MD6.5 R41.2 258.95,40.01 265.68,40.01 265.68,26.67 J21.3
KNX_ANAOUT_DIV  (via drill 0.6)
  Top 0.254: R41.1 R42.2 C22.1 262.89,36.84 v262.89,33.15 | U14.6 266.2,166.36 266.7,165.86 v266.95,165.86
  SI1 0.254: v266.95,165.86 266.95,157.35 275.08,157.35 274.95,116.97 274.95,111.63 274.57,111.63 274.57,101.85 275.34,101.85 275.21,33.15 v262.89,33.15
KNX_CSB
  Top 0.254: J23.2 240.41,20.57 240.41,34.8 242.44,34.8 242.44,44.32 243.71,44.32 MD6.18
KNX_RESETB
  Top 0.254: J21.5 270.76,31.75 270.76,40.64 260.22,40.64 260.22,44.07 256.41,44.07 MD6.8
KNX_RX  (via drill 0.5, 0.6)  (1 unrouted)
  Top 0.254: R31.2 MD6.15 | U24.2 264.67,24.51 v264.67,37.08 | 127.13,148.08 127.13,149.99 v126.24,149.99
  SI1 0.254: v126.24,149.99 126.24,155.96 148.21,155.96 148.21,150.88 154.18,150.88 v154.31,124.71
  SI2 0.254: v264.67,37.08 247.4,37.08 247.4,41.4 246.25,41.4 MD6.15
  Bottom 0.254: MD6.15 244.98,42.8 244.98,69.47 235.84,69.47 235.84,108.84 226.57,108.84 226.57,118.62 157.35,118.62 157.35,116.84 154.31,116.84 v154.31,124.71
KNX_SAVEB  (via drill 0.6)
  Top 0.254: U13.2 252.35,31.04 252.35,35.31 254.51,35.31 v254.51,36.07
  Bottom 0.254: J21.4 266.06,29.21 266.06,38.99 256.41,38.99 | 256.41,38.99 MD6.7 | v254.51,36.07 256.41,36.07 256.41,38.99
KNX_SCK
  Top 0.254: J23.3 243.59,20.57 243.59,40.77 244.98,40.77 244.98,44.07 248.79,44.07 MD6.14
KNX_TRIG  (via drill 0.6)
  Top 0.254: MD6.22 237.36,44.2 237.36,38.1 v239.27,38.1 | U13.5 v250.06,38.1
  SI1 0.254: J21.7 267.72,38.1 v250.06,38.1 v239.27,38.1
KNX_TX  (via drill 0.5, 0.6)  (1 unrouted)
  Top 0.254: U24.5 262.89,20.71 262.89,19.81 v262,19.81 | 127.76,148.08 127.76,149.61 128.91,149.61 v128.91,149.99
  SI1 0.254: v128.91,149.99 128.91,155.32 147.57,155.32 147.57,150.24 152.27,150.24 152.27,123.7 156.97,123.7 v156.97,124.71
  SI2 0.254: v262,19.81 260.99,19.81 260.99,36.07 257.18,36.07 257.18,35.05 252.09,35.05 252.09,36.07 244.98,36.07 244.98,44.2 246.25,44.2 MD6.16
  Bottom 0.254: MD6.16 246.25,70.48 236.85,70.48 236.85,109.73 227.58,109.73 227.58,119.25 157.48,119.13 156.97,119.76 v156.97,124.71
KNX_V2
  Top 0.254: MD6.1 266.7,42.8 266.7,44.32 272.16,44.32 272.16,21.59 J21.1
KNX_V20V
  Top 0.254: MD6.3 261.49,41.53 267.33,41.53 267.33,43.69 271.65,43.69 271.65,24.13 J21.2
KNX_XCLK
  SI2 0.254: J21.6 267.08,34.29 267.08,40.01 251.33,40.01 MD6.11
KNX_XCLKC
  Top 0.254: J23.1 234.82,20.57 234.82,26.92 239.78,26.92 239.78,35.56 240.54,35.56 240.54,40.77 238.63,40.77 MD6.21
LCD_DATA0  (via drill 0.5, 0.6)
  SI1 0.254: v268.35,134.37 258.7,140.59 239.27,140.72 239.27,140.08 202.95,140.08 | 202.82,140.08 202.95,140.08 | 202.95,140.08 189.48,126.11 94.49,104.39 94.36,104.39 v90.04,99.95
  Bottom 0.203: MD2.24 89.59,83.77 89.59,86.69
  Bottom 0.254: R1.1 v268.35,134.37 | 89.59,86.69 89.28,89.15 91.19,92.33 91.19,98.93 v90.04,99.95
LCD_DATA1  (via drill 0.5, 0.6)
  SI1 0.254: v268.35,119.76 261.37,113.03 236.09,113.03 236.09,113.41 193.04,113.41 108.08,92.71 102.36,89.28 91.44,89.28 v90.42,89.41
  Bottom 0.203: MD2.25 90.09,83.95 90.17,88.9
  Bottom 0.254: R2.2 v268.35,119.76 | 90.17,88.9 v90.42,89.41
LCD_DATA2  (via drill 0.5, 0.6)
  SI1 0.254: v265.81,134.37 257.3,139.95 240.16,140.08 240.16,139.45 203.07,139.45 189.87,125.6 95.12,103.89 95,103.89 v91.57,100.08
  Bottom 0.203: MD2.26 90.6,83.44 90.6,88.01
  Bottom 0.254: R3.1 v265.81,134.37 | 90.6,88.01 91.44,89.28 91.69,90.81 91.69,99.31 v91.57,100.08
LCD_DATA3  (via drill 0.5, 0.6)
  SI1 0.254: v265.81,119.76 259.33,113.67 236.73,113.67 236.73,114.05 193.04,114.05 107.31,93.34 102.11,90.17 v92.46,90.17
  Bottom 0.203: MD2.27 91.19,83.24 91.19,87.5
  Bottom 0.254: R4.2 v265.81,119.76 | 91.19,87.5 91.82,88.65 v92.46,90.17
LCD_DATA4  (via drill 0.5, 0.6)
  SI1 0.254: v263.27,134.37 255.65,139.45 240.79,139.45 240.79,138.81 203.58,138.81 190.25,124.97 95.63,103.38 v93.09,100.2
  Bottom 0.203: MD2.28 91.62,84.66 91.64,87.15
  Bottom 0.254: R5.1 v263.27,134.37 | 91.64,87.15 92.71,88.77 93.34,89.66 93.34,100.2 v93.09,100.2
LCD_DATA5  (via drill 0.5, 0.6)
  SI1 0.254: v263.27,119.76 257.56,114.3 237.36,114.3 237.36,114.68 193.04,114.68 106.55,93.98 101.73,91.06 91.44,91.06 90.17,90.68 88.77,90.17 86.36,88.9 84.96,88.01 v84.71,86.74
  Bottom 0.203: MD2.15 85.09,83.95 85.09,86.23
  Bottom 0.254: R6.2 v263.27,119.76 | 85.09,86.23 v84.71,86.74
LCD_DATA6  (via drill 0.5, 0.6)
  SI1 0.254: v260.73,134.37 254.25,138.81 241.55,138.81 241.55,138.18 203.96,138.18 190.75,124.33 96.39,102.87 96.27,102.87 93.34,99.31 92.33,98.42 89.92,98.42 v88.9,97.41
  Bottom 0.203: 85.6,83.44 85.6,89.28
  Bottom 0.254: R7.1 v260.73,134.37 | MD2.16 85.6,83.44 | 85.6,89.28 85.34,90.17 v88.9,97.41
LCD_DATA7  (via drill 0.5, 0.6)
  SI1 0.254: v260.73,119.76 255.65,114.94 238,114.94 238,115.32 193.04,115.32 105.79,94.61 101.22,91.57 90.93,91.57 89.92,91.31 89.28,91.06 88.52,90.81 v86.36,90.04
  Bottom 0.203: 86.11,83.57 86.11,88.27